# Altium project BMS_Test_Stand.PrjPcb
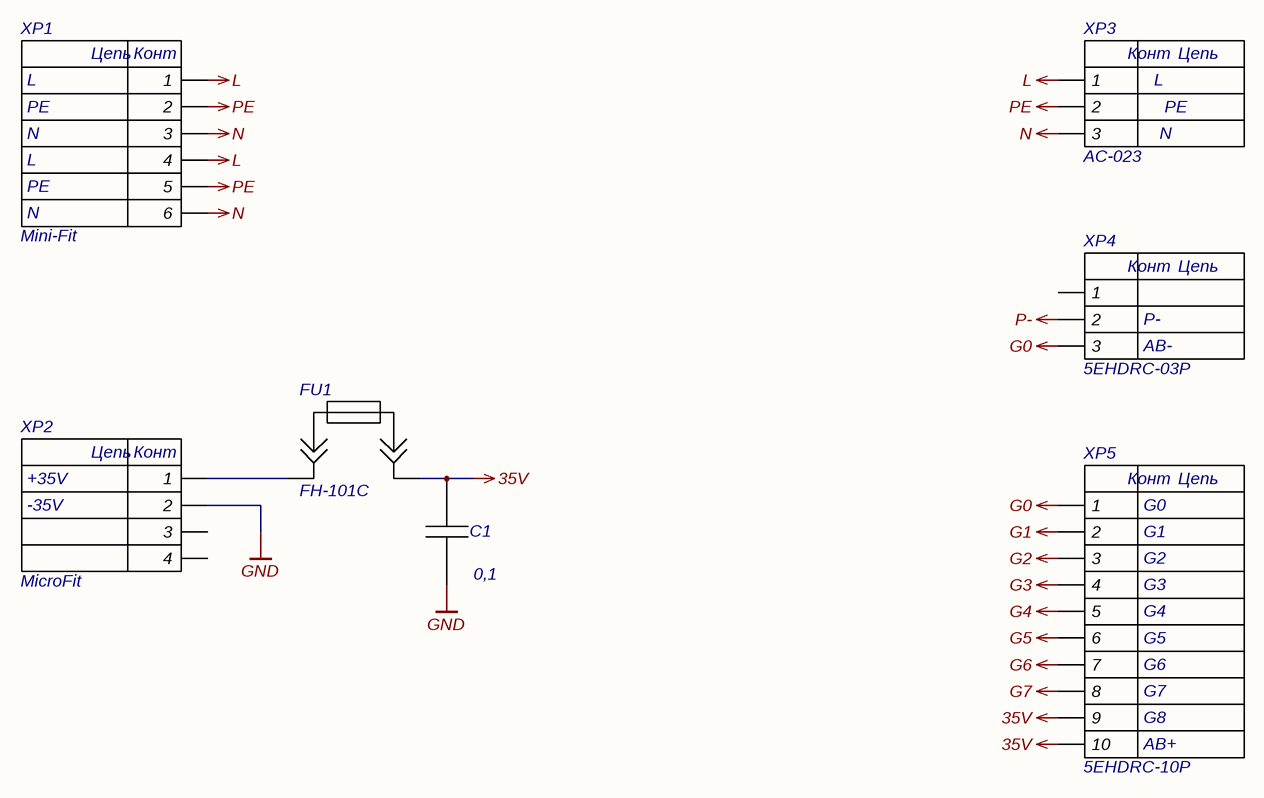
[diagram p0: Conn.SchDoc]
13 sheets, 426 parts. Net scope: global (net labels, ports and power ports of the same name join across sheets).
Board file: Stand.PcbDoc
Sheets:
  Conn.SchDoc
  Mode.SchDoc
  Power.SchDoc
  MCU.SchDoc
  Interface.SchDoc
  BI1.SchDoc
  BI2.SchDoc
  BI3.SchDoc
  BI4.SchDoc
  BI5.SchDoc
  BI6.SchDoc
  BI7.SchDoc
  BI8.SchDoc

## Sheet Conn.SchDoc: Модуль измерительный
size 420 x 297 mm; CheckedBy: Беляев; Author: Петрова; CompanyName: Университет ИТМО; SheetNumber: 1; SheetTotal: 13; PageSetup: Record=PageOptions|CenterHorizontal=True|CenterVertical=True|PrintScale=0.94|XCorrection=1.00|YCorrection=1.00|PrintKind=1|BorderSize=5000000|LeftOffset=0|BottomOffset=0|Orientation=1|PaperLength=1000|PaperWidth=1000|Scale=100|PaperSource=7|PrintQuality=-4|MediaType=1|DitherType=10|PaperKind=A4|PrintScaleMode=1; DecimalNumber: СНАБ.468222.001 ЭЗ; Name: Модуль измерительный; DocumentName: Sheet1.SCHDOC

### Parts
C1  0,1  [С0805]
FU1  FH-101C  [FH-101C]
XP1  Mini-Fit  P6: N  P5: PE  P4: L  [MF2x3MA]
XP2  MicroFit  P2: -35V  P1: +35V  [MF3-04MA]
XP3  AC-023  [IEC-C14]
XP4  5EHDRC-03P  P2: P-  P3: AB-  [5EHDRC-03P]
XP5  5EHDRC-10P  P6: G5  P1: G0  P2: G1  P3: G2  P4: G3  P5: G4  P7: G6  P8: G7  P9: G8  P10: AB+  [5EHDRC-10P]

### Nets
35V: C1.2 FU1.2 XP5.9 XP5.10
G0: XP4.3 XP5.1
G1: XP5.2
G2: XP5.3
G3: XP5.4
G4: XP5.5
G5: XP5.6
G6: XP5.7
G7: XP5.8
GND: C1.1 XP2.2
L: XP1.1 XP1.4 XP3.1
N: XP1.3 XP1.6 XP3.3
P-: XP4.2
PE: XP1.2 XP1.5 XP3.2
NetFU1_1: FU1.1 XP2.1

Not connected (* = marked no-connect by the designer): XP2 3 4; XP4 1

### Notes on the sheet
- Перв.примен.
- Справ.№
- Подп. и дата
- Инв.№ дубл.
- Взам.инв.№
- Подп.и дата
- Разраб.
- Изм.
- Лист
- № докум.
- Подп.
- Дата
- Лит.
- Масса
- Масштаб
- Т.контр.
- Пров.
- Схема электрическая
- принципиальная
- Листов
- Инв.№ подл.
- Утв.
- Н.контр.
- Копировал
- Формат  A3
- (in symbol 5EHDRC-03P) Конт; Цепь
- (in symbol 5EHDRC-10P) Конт; Цепь
- (in symbol 43045-0412) Цепь; Конт
- (in symbol AC-023) Конт; Цепь; L; PE; N
- (in symbol MF2x3MA) Цепь; Конт

### Library data of the parts
C1 = Chip Capasitor: Чип-конденсатор; Value: 0,1
FU1 = FH-101C: Fuse holder 5x20mm; Manufacturer: Dragon City Industries; Case: FH-101C; Name: FH-101C; Datasheet: https://static.chipdip.ru/lib/550/DOC014550336.pdf
XP1 = MF2x3MA: Mini-Fit 4,2mm A Male 6 pin; Manufacturer: Connfly Electronic Co.; Name: DS1073-01-2x3-MVT6; Case: MF2x3MA; P3: N; P2: PE; P1: L
XP2 = 43045-0412: MicroFit 3mm RA Male 4 pin; Manufacturer: Molex Incorporated; Case: MF3-04MA; Name: 43045-0412; TU: *
XP3 = AC-023: Разъём питания AC, одинарный; Manufacturer: RUICHI; Name: AC-023
XP4 = 5EHDRC-03P: Клеммник 3 конт. "вилка" шаг 5.00 мм; Manufacturer: Dinkle Enterprise; Name: 5EHDRC-03P; Datasheet: https://static.chipdip.ru/lib/008/DOC004008828.pdf
XP5 = 5EHDRC-10P: Клеммник 10 конт. "вилка" шаг 5.00 мм; Manufacturer: Dinkle Enterprise; Name: 5EHDRC-10P; Datasheet: https://www.lcsc.com/datasheet/lcsc_datasheet_2311281934_Dinkle-5EHDR-10P_C5515183.pdf

## Sheet Mode.SchDoc: Наименование
size 420 x 297 mm; ApprovedBy: Утвердил; CheckedBy: Проверил; Author: Разработал; CompanyName: ВлГУ; DrawnBy: Н.Контр; Engineer: Т.Контр; SheetNumber: 2; SheetTotal: 1; PageSetup: Record=PageOptions|CenterHorizontal=True|CenterVertical=True|PrintScale=0.94|XCorrection=1.00|YCorrection=1.00|PrintKind=1|BorderSize=5000000|LeftOffset=0|BottomOffset=0|Orientation=1|PaperLength=1000|PaperWidth=1000|Scale=100|PaperSource=7|PrintQuality=-4|MediaType=1|DitherType=10|PaperKind=A4|PrintScaleMode=1; DecimalNumber: СНАБ.468222.001 ЭЗ; HeadOfSector: Нач. сектора; MainDevice: Перв.примен.; Name: Наименование; DocumentName: Sheet1.SCHDOC
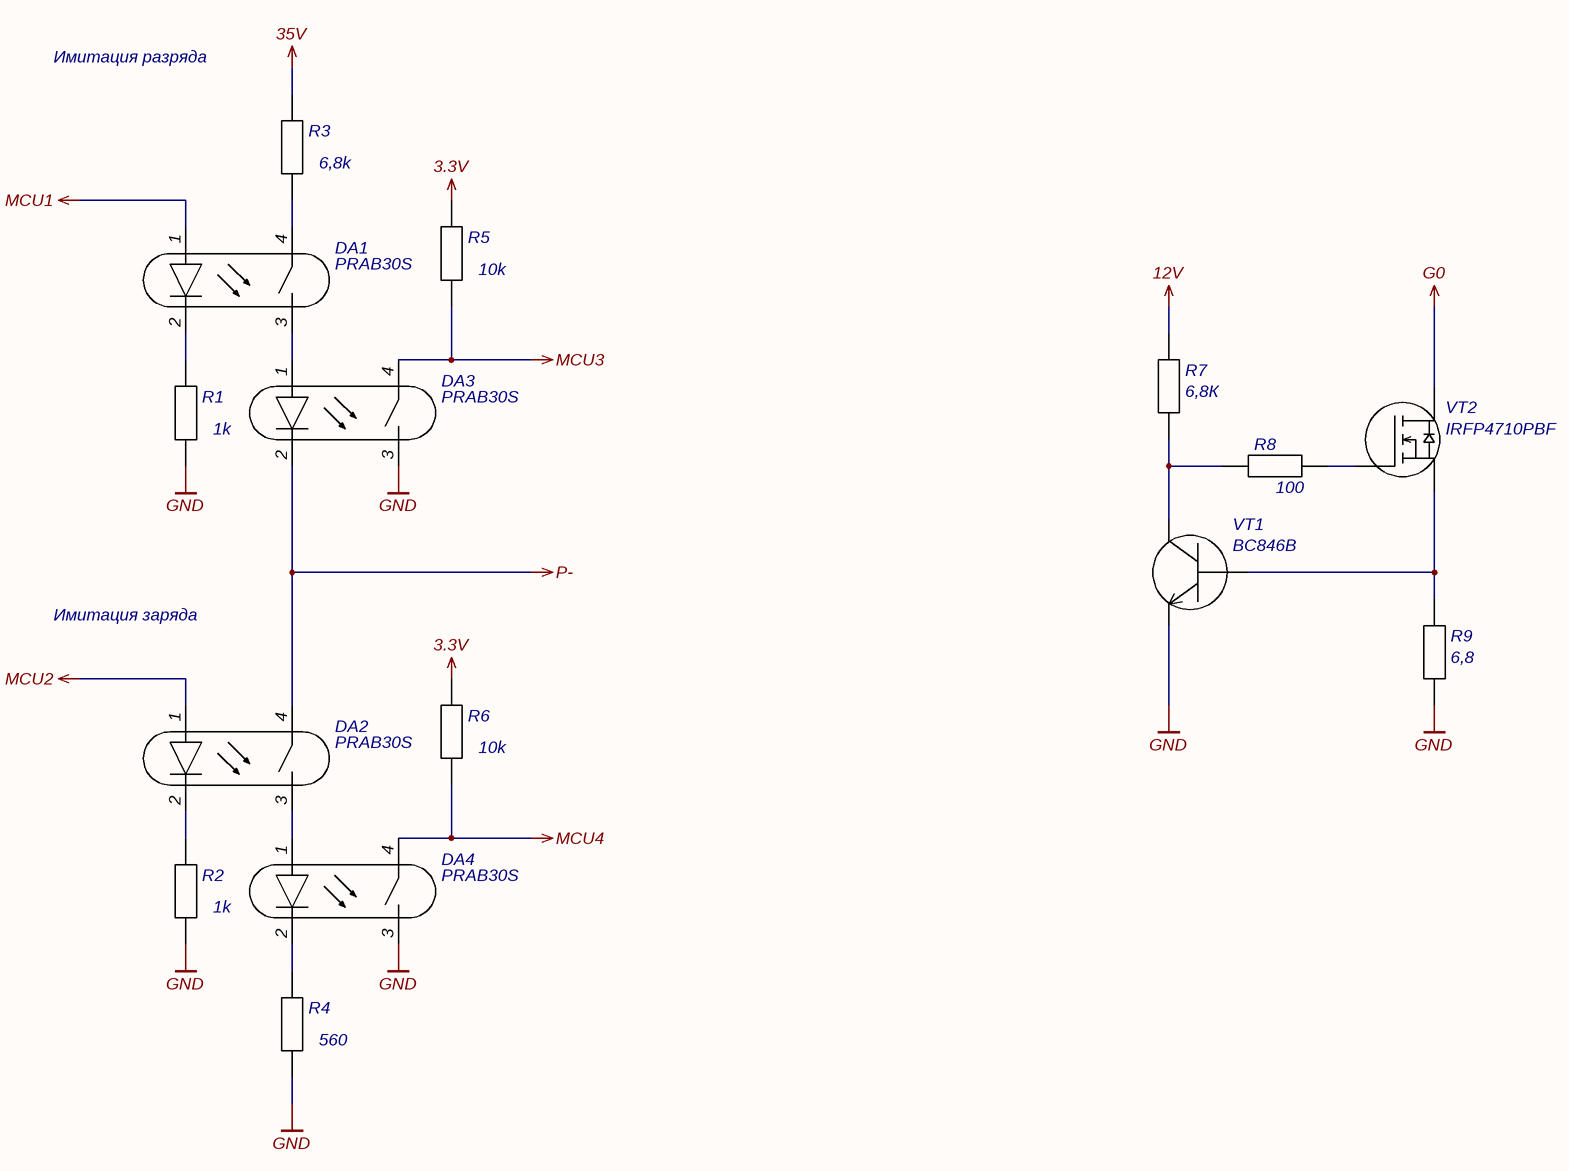
[diagram p1: Mode.SchDoc]

### Parts
DA1  PRAB30S  [SOP-4]
DA2  PRAB30S  [SOP-4]
DA3  PRAB30S  [SOP-4]
DA4  PRAB30S  [SOP-4]
R1  1k  [R0603]
R2  1k  [R0603]
R3  6,8k  [R1206]
R4  560  [R1206]
R5  10k  [R0603]
R6  10k  [R0603]
R7  6,8К  [R1206]
R8  100  [R0603]
R9  6,8  [SQP 5W]
VT1  BC846B  [SOT-23]
VT2  IRFP4710PBF  [TO-247AC]

### Nets
3.3V: R5.2 R6.2
12V: R7.2
35V: R3.2
G0: VT2.2(D)
GND: DA3.3(Out1.2) DA4.3(Out1.2) R1.1 R2.1 R4.1 R9.1 VT1.2(E)
MCU1: DA1.1(A1)
MCU2: DA2.1(A1)
MCU3: DA3.4(Out1.1) R5.1
MCU4: DA4.4(Out1.1) R6.1
P-: DA2.4(Out1.1) DA3.2(K1)
NetDA1_2: DA1.2(K1) R1.2
NetDA1_3: DA1.3(Out1.2) DA3.1(A1)
NetDA1_4: DA1.4(Out1.1) R3.1
NetDA2_2: DA2.2(K1) R2.2
NetDA2_3: DA2.3(Out1.2) DA4.1(A1)
NetDA4_2: DA4.2(K1) R4.2
NetR7_1: R7.1 R8.1 VT1.3(C)
NetR8_2: R8.2 VT2.1(G)
NetR9_2: R9.2 VT1.1(B) VT2.3(S)

### Notes on the sheet
- Имитация разряда
- Имитация заряда
- Подп. и дата
- Инв.№ дубл.
- Взам.инв.№
- Подп.и дата
- Инв.№ подл.
- Изм.
- Лист
- № докум.
- Подп.
- Дата
- Копировал
- Формат  A3

### Library data of the parts
DA1-DA4 = PRAB30S: Реле твердотельное с оптической развязкой; Manufacturer: ОАО «Протон»; Case: SOP-4; Name: PRAB30S; Datasheet: https://static.chipdip.ru/lib/271/DOC000271061.pdf
R1-R8 = Chip Resistor: Чип-резистор
  R1 R2: Value: 1k
  R3: Value: 6,8k
  R4: Value: 560
  R5 R6: Value: 10k
  R7: Value: 6,8К
  R8: Value: 100
R9 = Resistor: Резистор; Value: 6,8
VT1 = BC846B: Транзистор биполярный NPN, 65В; Manufacturer: Nexperia B.V.; Case: SOT-23; Name: BC846B; Datasheet: https://static.chipdip.ru/lib/551/DOC012551042.pdf
VT2 = IRFP4710PBF: Транзистор MOSFET N-канал, 100В; Manufacturer: INFINEON TECHNOLOGIES AG.; Case: TO-247AC; Name: IRFP4710PBF; Datasheet: https://static.chipdip.ru/lib/205/DOC000205410.pdf

## Sheet Power.SchDoc
size 420 x 297 mm; DocumentNumber: 3; SheetNumber: 3; SheetTotal: 13; DecimalNumber: СНАБ.468222.001 ЭЗ
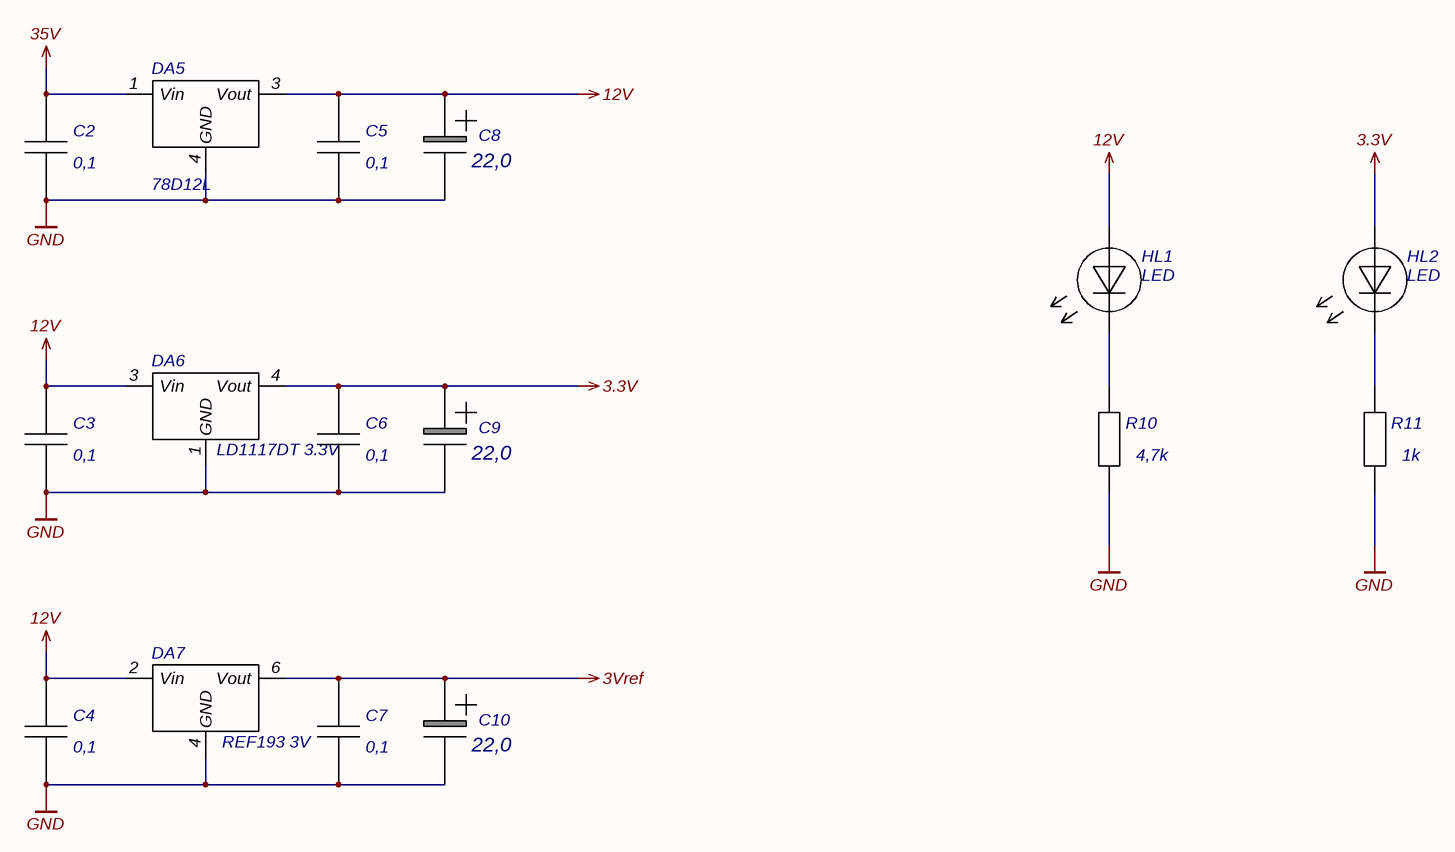
[diagram p2: Power.SchDoc]

### Parts
C2  0,1  [С0805]
C3  0,1  [С0805]
C4  0,1  [С0805]
C5  0,1  [С0805]
C6  0,1  [С0805]
C7  0,1  [С0805]
C8  22,0  [C_tant 3(С-type)]
C9  22,0  [C_tant 3(С-type)]
C10  22,0  [C_tant 3(С-type)]
DA5  78D12L  [DPAK]
DA6  LD1117DT 3.3V  [DPAK]
DA7  REF193 3V  [SOP-8 (SOIC)]
HL1  LED  [LED 5mm (L-7113IT)]
HL2  LED  [LED 5mm (L-7113IT)]
R10  4,7k  [R0603]
R11  1k  [R0603]

### Nets
3.3V: C6.2 C9.1 DA6.4(Vout) HL2.2(A)
3Vref: C7.2 C10.1 DA7.6(Vout)
12V: C3.2 C4.2 C5.2 C8.1 DA5.3(Vout) DA6.3(Vin) DA7.2(Vin) HL1.2(A)
35V: C2.2 DA5.1(Vin)
GND: C2.1 C3.1 C4.1 C5.1 C6.1 C7.1 C8.2 C9.2 C10.2 DA5.4(GND) DA6.1(GND) DA7.4(GND) R10.1 R11.1
NetHL1_1: HL1.1(K) R10.2
NetHL2_1: HL2.1(K) R11.2

### Notes on the sheet
- Подп. и дата
- Инв.№ дубл.
- Взам.инв.№
- Подп.и дата
- Инв.№ подл.
- Изм.
- Лист
- № докум.
- Подп.
- Дата
- Копировал
- Формат  A3

### Library data of the parts
C2-C7 = Chip Capasitor: Чип-конденсатор; Value: 0,1
C8-C10 = К53-67 (3/C): Чип конденсатор (3/C) тант.; Manufacturer: KEMET; Partnumber: Т491С226К010АТ; Case: C_tant 3(С-type); TU: -; Value: 22,0
DA5 = 78D12L: Стабилизатор напряжения, 12В; Manufacturer: UTD Semiconductor Co.,Ltd; Case: DPAK (TO-252); Name: 78D12L; TU: *; Datasheet: https://static.chipdip.ru/lib/619/DOC025619012.pdf
DA6 = LD1117DT33TR: LDO-регулятор напряжения, 3.3В; Manufacturer: STMicroelectronics; Case: DPAK; Name: LD1117DT33TR; Datasheet: https://static.chipdip.ru/lib/677/DOC011677089.pdf
DA7 = REF193: Источник опорного напряжения, 3В; Manufacturer: Analog Devices; Name: REF193GSZ-REEL; Case: SOP-8; Datasheet: https://static.chipdip.ru/lib/039/DOC012039028.pdf
HL1 HL2 = LED: Светодиод, d=5мм; Manufacturer: Kingbright; Name: L-7113IT; Case: L-7113IT; Datasheet: https://static.chipdip.ru/lib/771/DOC059771173.pdf
R10 R11 = Chip Resistor: Чип-резистор
  R10: Value: 4,7k
  R11: Value: 1k

## Sheet MCU.SchDoc
size 420 x 297 mm; DocumentNumber: 4; SheetNumber: 4; SheetTotal: 13; DecimalNumber: СНАБ.468222.001 ЭЗ
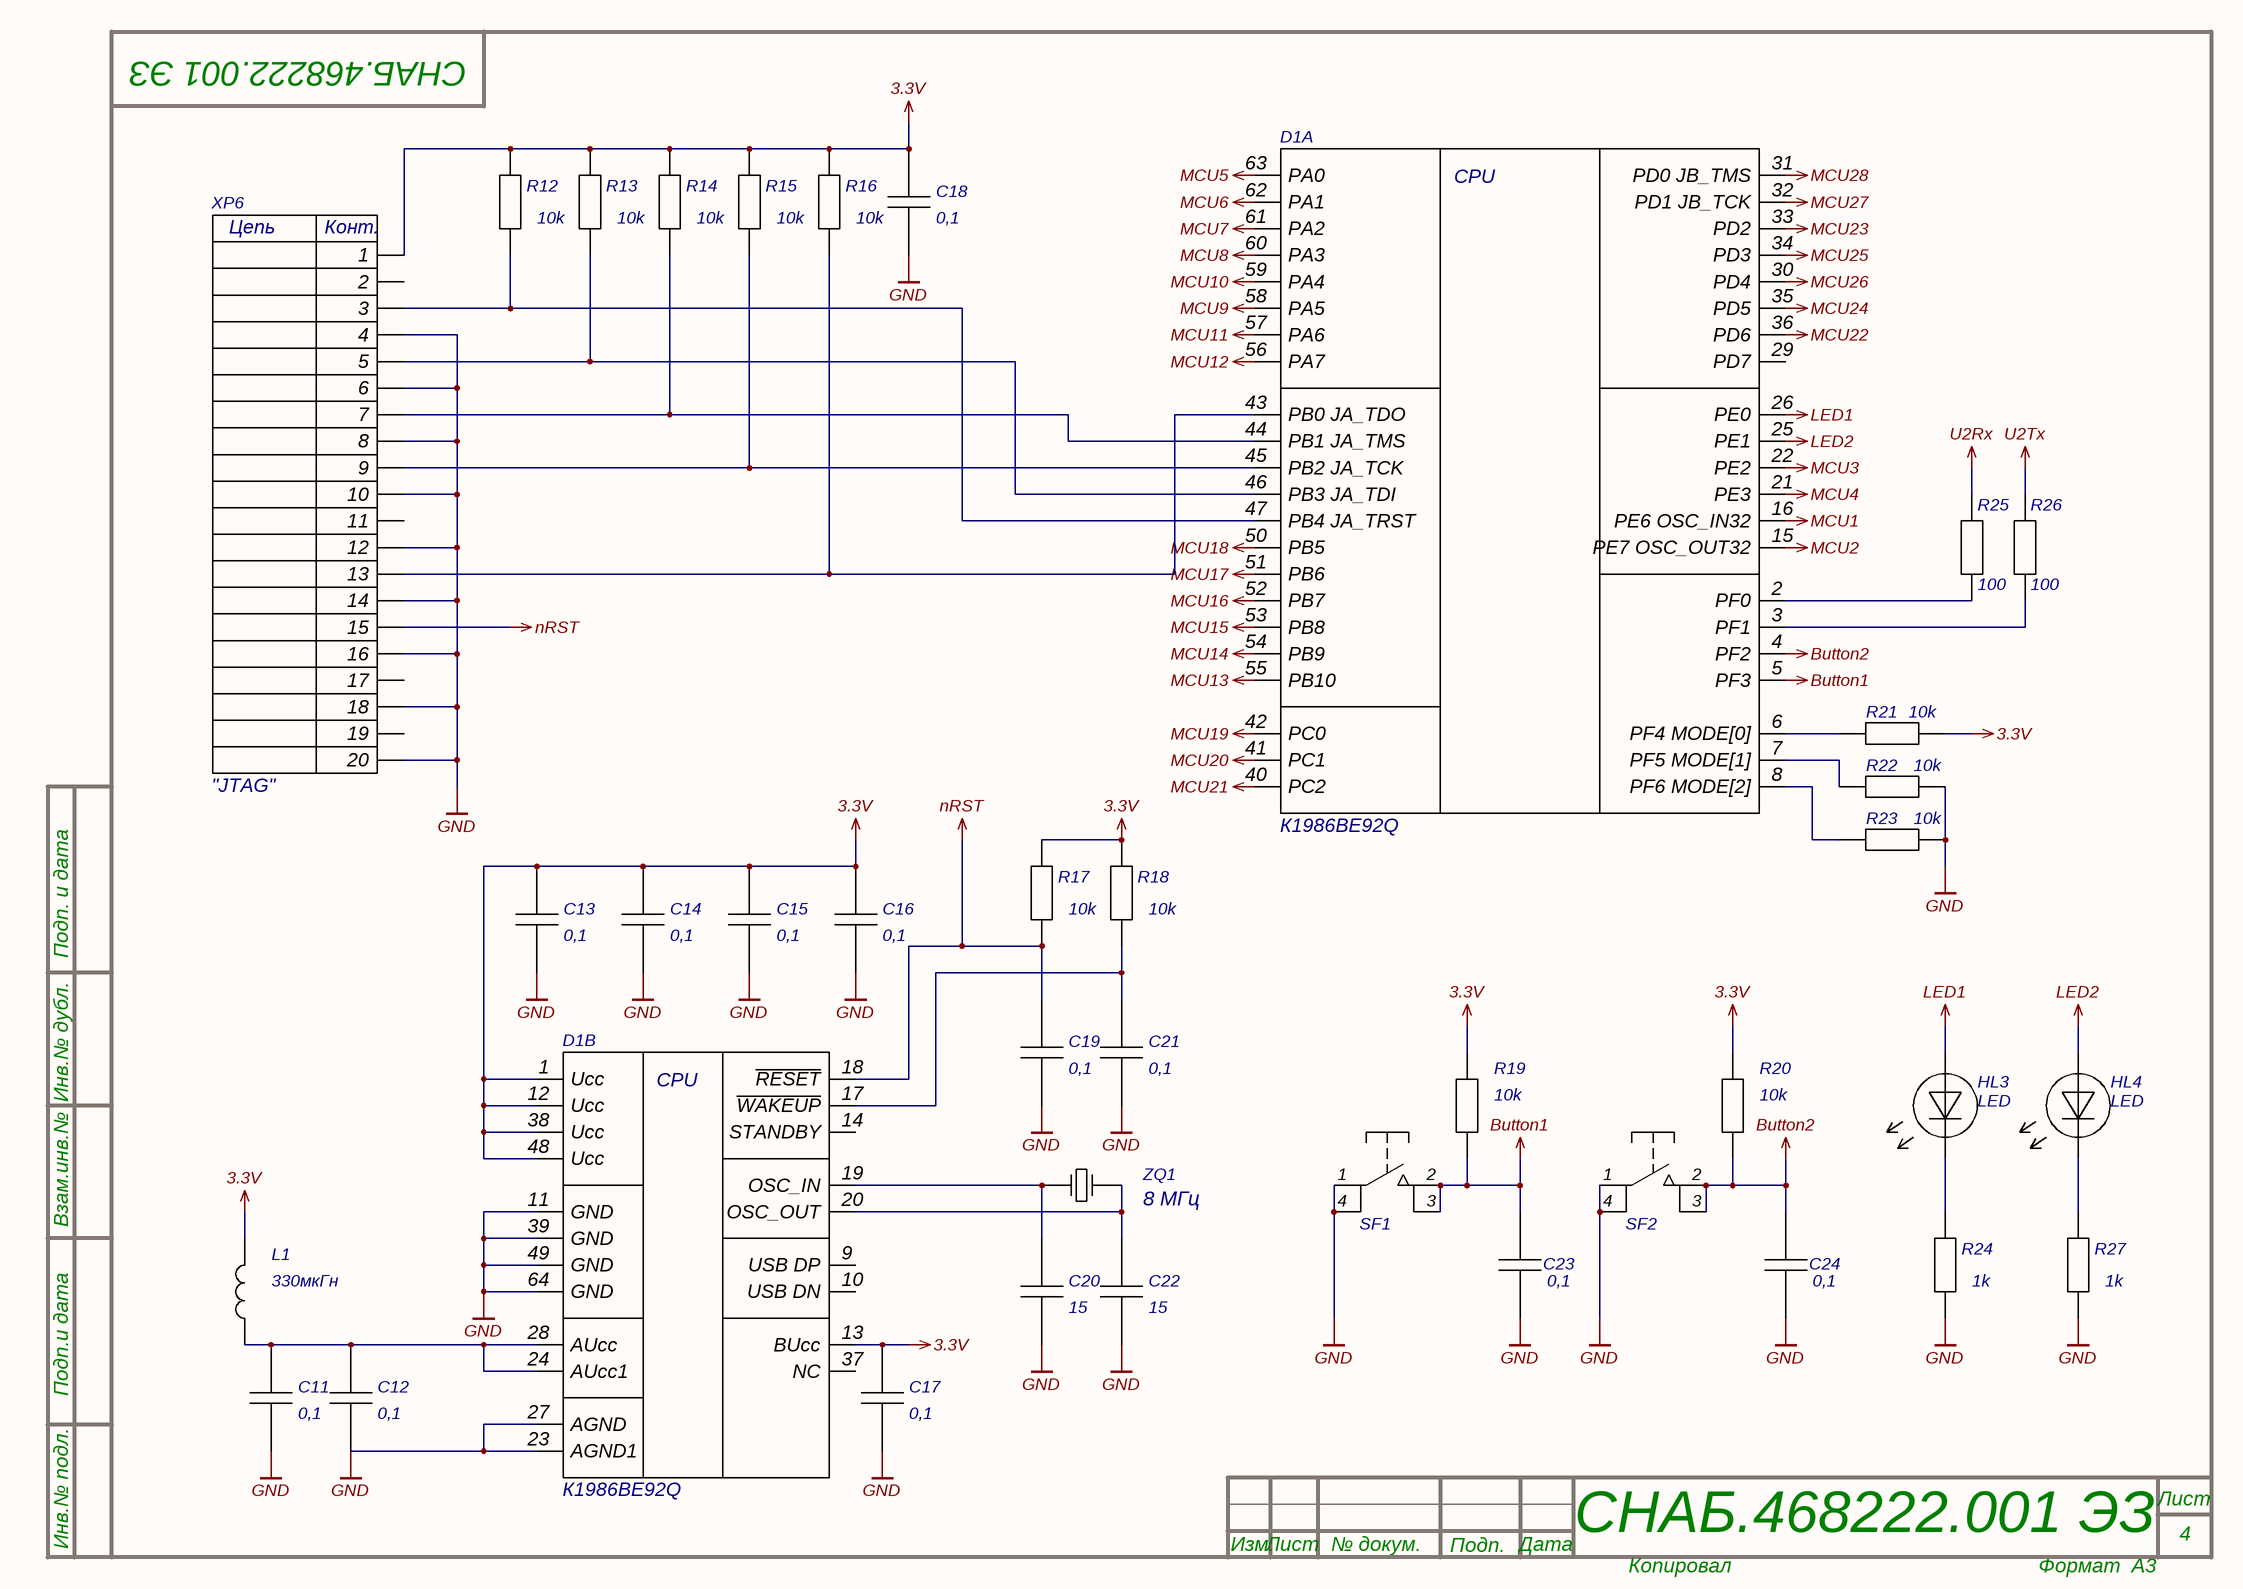
[diagram p3: MCU.SchDoc]

### Parts
C11  0,1  [C0603]
C12  0,1  [C0603]
C13  0,1  [C0603]
C14  0,1  [C0603]
C15  0,1  [C0603]
C16  0,1  [C0603]
C17  0,1  [C0603]
C18  0,1  [C0603]
C19  0,1  [C0603]
C20  15  [C0603]
C21  0,1  [C0603]
C22  15  [C0603]
C23  0,1  [C0603]
C24  0,1  [C0603]
D1  К1986ВЕ92Q  [LQFP64]  (parts A,B of 2)
HL3  LED  [LED 5mm (L-7113IT)]
HL4  LED  [LED 5mm (L-7113IT)]
L1  330мкГн  [LQH43M (1812)]
R12  10k  [R0805]
R13  10k  [R0805]
R14  10k  [R0805]
R15  10k  [R0805]
R16  10k  [R0805]
R17  10k  [R0805]
R18  10k  [R0805]
R19  10k  [R0603]
R20  10k  [R0603]
R21  10k  [R0805]
R22  10k  [R0805]
R23  10k  [R0805]
R24  1k  [R0805]
R25  100  [R0805]
R26  100  [R0805]
R27  1k  [R0805]
SF1  0650HIM-130G-G  [TC-0103]  (value not drawn)
SF2  0650HIM-130G-G  [TC-0103]  (value not drawn)
XP6  "JTAG"  [IDC_20]
ZQ1  8 МГц  [HC-49SM]

### Nets
3.3V: C13.2 C14.2 C15.2 C16.2 C17.2 C18.2 D1.1(Ucc) D1.12(Ucc) D1.13(BUcc) D1.38(Ucc) D1.48(Ucc) L1.2 R12.2 R13.2 R14.2 R15.2 R16.2 R17.2 R18.2 R19.1 R20.1 R21.2 XP6.1
Button1: C23.2 D1.5(PF3) R19.2 SF1.2 SF1.3
Button2: C24.2 D1.4(PF2) R20.2 SF2.2 SF2.3
GND: C11.1 C12.1 C13.1 C14.1 C15.1 C16.1 C17.1 C18.1 C19.1 C20.1 C21.1 C22.1 C23.1 C24.1 D1.11(GND) D1.23(AGND1) D1.27(AGND) D1.39(GND) D1.49(GND) D1.64(GND) R22.2 R23.2 R24.1 R27.1 SF1.1 SF1.4 SF2.1 SF2.4 XP6.4 XP6.6 XP6.8 XP6.10 XP6.12 XP6.14 XP6.16 XP6.18 XP6.20
LED1: D1.26(PE0) HL3.2(A)
LED2: D1.25(PE1) HL4.2(A)
MCU1: D1.16(PE6_OSC_IN32)
MCU2: D1.15(PE7_OSC_OUT32)
MCU3: D1.22(PE2)
MCU4: D1.21(PE3)
MCU5: D1.63(PA0)
MCU6: D1.62(PA1)
MCU7: D1.61(PA2)
MCU8: D1.60(PA3)
MCU9: D1.58(PA5)
MCU10: D1.59(PA4)
MCU11: D1.57(PA6)
MCU12: D1.56(PA7)
MCU13: D1.55(PB10)
MCU14: D1.54(PB9)
MCU15: D1.53(PB8)
MCU16: D1.52(PB7)
MCU17: D1.51(PB6)
MCU18: D1.50(PB5)
MCU19: D1.42(PC0)
MCU20: D1.41(PC1)
MCU21: D1.40(PC2)
MCU22: D1.36(PD6)
MCU23: D1.33(PD2)
MCU24: D1.35(PD5)
MCU25: D1.34(PD3)
MCU26: D1.30(PD4)
MCU27: D1.32(PD1_JB_TCK)
MCU28: D1.31(PD0_JB_TMS)
nRST: C19.2 D1.18(~{RESET}) R17.1 XP6.15
U2Rx: R25.2
U2Tx: R26.2
NetC11_2: C11.2 C12.2 D1.24(AUcc1) D1.28(AUcc) L1.1
NetC20_2: C20.2 D1.19(OSC_IN) ZQ1.1
NetC21_2: C21.2 D1.17(~{WAKEUP}) R18.1
NetC22_2: C22.2 D1.20(OSC_OUT) ZQ1.2
NetD1_2: D1.2(PF0) R25.1
NetD1_3: D1.3(PF1) R26.1
NetD1_6: D1.6(PF4_MODE[0]) R21.1
NetD1_7: D1.7(PF5_MODE[1]) R22.1
NetD1_8: D1.8(PF6_MODE[2]) R23.1
NetD1_43: D1.43(PB0_JA_TDO) R16.1 XP6.13
NetD1_44: D1.44(PB1_JA_TMS) R14.1 XP6.7
NetD1_45: D1.45(PB2_JA_TCK) R15.1 XP6.9
NetD1_46: D1.46(PB3_JA_TDI) R13.1 XP6.5
NetD1_47: D1.47(PB4_JA_TRST) R12.1 XP6.3
NetHL3_1: HL3.1(K) R24.2
NetHL4_1: HL4.1(K) R27.2

Not connected (* = marked no-connect by the designer): D1 9(USB_DP) 10(USB_DN) 14(STANDBY) 29(PD7) 37(NC); XP6 2 11 17 19

### Notes on the sheet
- Подп. и дата
- Инв.№ дубл.
- Взам.инв.№
- Подп.и дата
- Инв.№ подл.
- Изм.
- Лист
- № докум.
- Подп.
- Дата
- Копировал
- Формат  A3
- (in symbol JTAG_20 L) Цепь; Конт.
- (in symbol К1986ВЕ92QI(C)_2parts(LQFP64), part A) CPU
- (in symbol К1986ВЕ92QI(C)_2parts(LQFP64), part B) CPU

### Library data of the parts
C11-C24 = Chip Capasitor: Чип-конденсатор
  C11-C19 C21 C23 C24: Value: 0,1
  C20 C22: Value: 15
D1 = К1986ВЕ92QI(C)_2parts(LQFP64): 32бит микроконтроллер CortexM3; Manufacturer: АО «ПКК Миландр»; TU: ТСКЯ.431296.021СП; Case: LQFP64, пласт.; Name: К1986ВЕ92Q
HL3 HL4 = LED: as HL1 on sheet Power; Case: L-7113IT; Datasheet: https://static.chipdip.ru/lib/771/DOC059771173.pdf
L1 = LQH43MN331K: Чип-индуктивность 95мА, 330мкГн 10%; Manufacturer: Murata Electronics; TU: JELF243A-0043P-01; Case: LQH43M (1812); Name: LQH43MN331K; Datasheet: https://static.chipdip.ru/lib/442/DOC012442357.pdf
R12-R27 = Chip Resistor: Чип-резистор
  R12-R23: Value: 10k
  R24 R27: Value: 1k
  R25 R26: Value: 100
SF1 SF2 = 0650HIM-130G-G: Кнопка тактовая, h=5мм; Manufacturer: Switronic Industrial; Name: 0613HIM-130G-G; Case: TC-0103; Datasheet: https://static.chipdip.ru/lib/154/DOC001154468.pdf
XP6 = JTAG_20 L: J-TAG Connector; Name: DS1013-20S; Manufacturer: *; Case: *
ZQ1 = QuartzRes: Кварцевый резонатор, 8 МГц; Manufacturer: SJK; Case: HC-49SM; Name: QuartzRes; Datasheet: https://static.chipdip.ru/lib/086/DOC053086711.pdf

## Sheet Interface.SchDoc
size 420 x 297 mm; DocumentNumber: 5; SheetNumber: 5; SheetTotal: 13; DecimalNumber: СНАБ.468222.001 ЭЗ
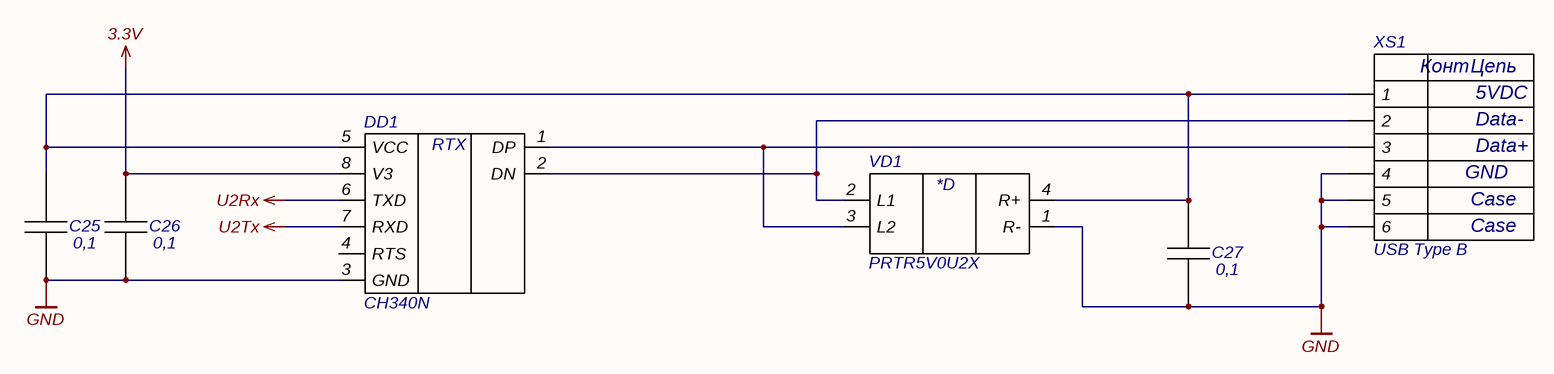
[diagram p4: Interface.SchDoc]

### Parts
C25  0,1  [C0603]
C26  0,1  [C0603]
C27  0,1  [C0603]
DD1  CH340N  [SOP-8 (SOIC)]
VD1  PRTR5V0U2X  [SOT-143]
XS1  USB Type B  [USB Type B]

### Nets
3.3V: C26.2 DD1.8(V3)
GND: C25.1 C26.1 C27.1 DD1.3(GND) VD1.1(R-) XS1.4 XS1.5 XS1.6
U2Rx: DD1.6(TXD)
U2Tx: DD1.7(RXD)
NetC25_2: C25.2 C27.2 DD1.5(VCC) VD1.4(R+) XS1.1
NetDD1_1: DD1.1(DP) VD1.3(L2) XS1.3
NetDD1_2: DD1.2(DN) VD1.2(L1) XS1.2

Not connected (* = marked no-connect by the designer): DD1 4(RTS)

### Notes on the sheet
- Подп. и дата
- Инв.№ дубл.
- Взам.инв.№
- Подп.и дата
- Инв.№ подл.
- Изм.
- Лист
- № докум.
- Подп.
- Дата
- Копировал
- Формат  A3
- (in symbol CH340N) RTX
- (in symbol PRTR5V0U2X) *D
- (in symbol USB Type B) Конт; Цепь; 5VDC; Data-; Data+; GND; Case

### Library data of the parts
C25-C27 = Chip Capasitor: Чип-конденсатор; Value: 0,1
DD1 = CH340N: Преобразователь интерфейса USB в UART; Manufacturer: Nanjing Qinheng Microelectronics; Case: SOP-8; Name: CH340N; Datasheet: https://static.chipdip.ru/lib/375/DOC030375417.pdf
VD1 = PRTR5V0U2X: Защитная диодная сборка от статического заряда; Manufacturer: UTD Semiconductor (UMW); Case: SOT-143; Name: PRTR5V0U2X; Datasheet: https://static.chipdip.ru/lib/303/DOC021303242.pdf
XS1 = USB Type B: Гнездо USB тип B; Manufacturer: Connfly electronic (Zhenqin); Name: USBB-1J; Case: USBB-1J (DS1099-W); Datasheet: https://static.chipdip.ru/lib/252/DOC051252493.pdf

## Sheet BI1.SchDoc
size 420 x 297 mm; DocumentNumber: 6; SheetNumber: 6; SheetTotal: 13; DecimalNumber: СНАБ.468222.001 ЭЗ
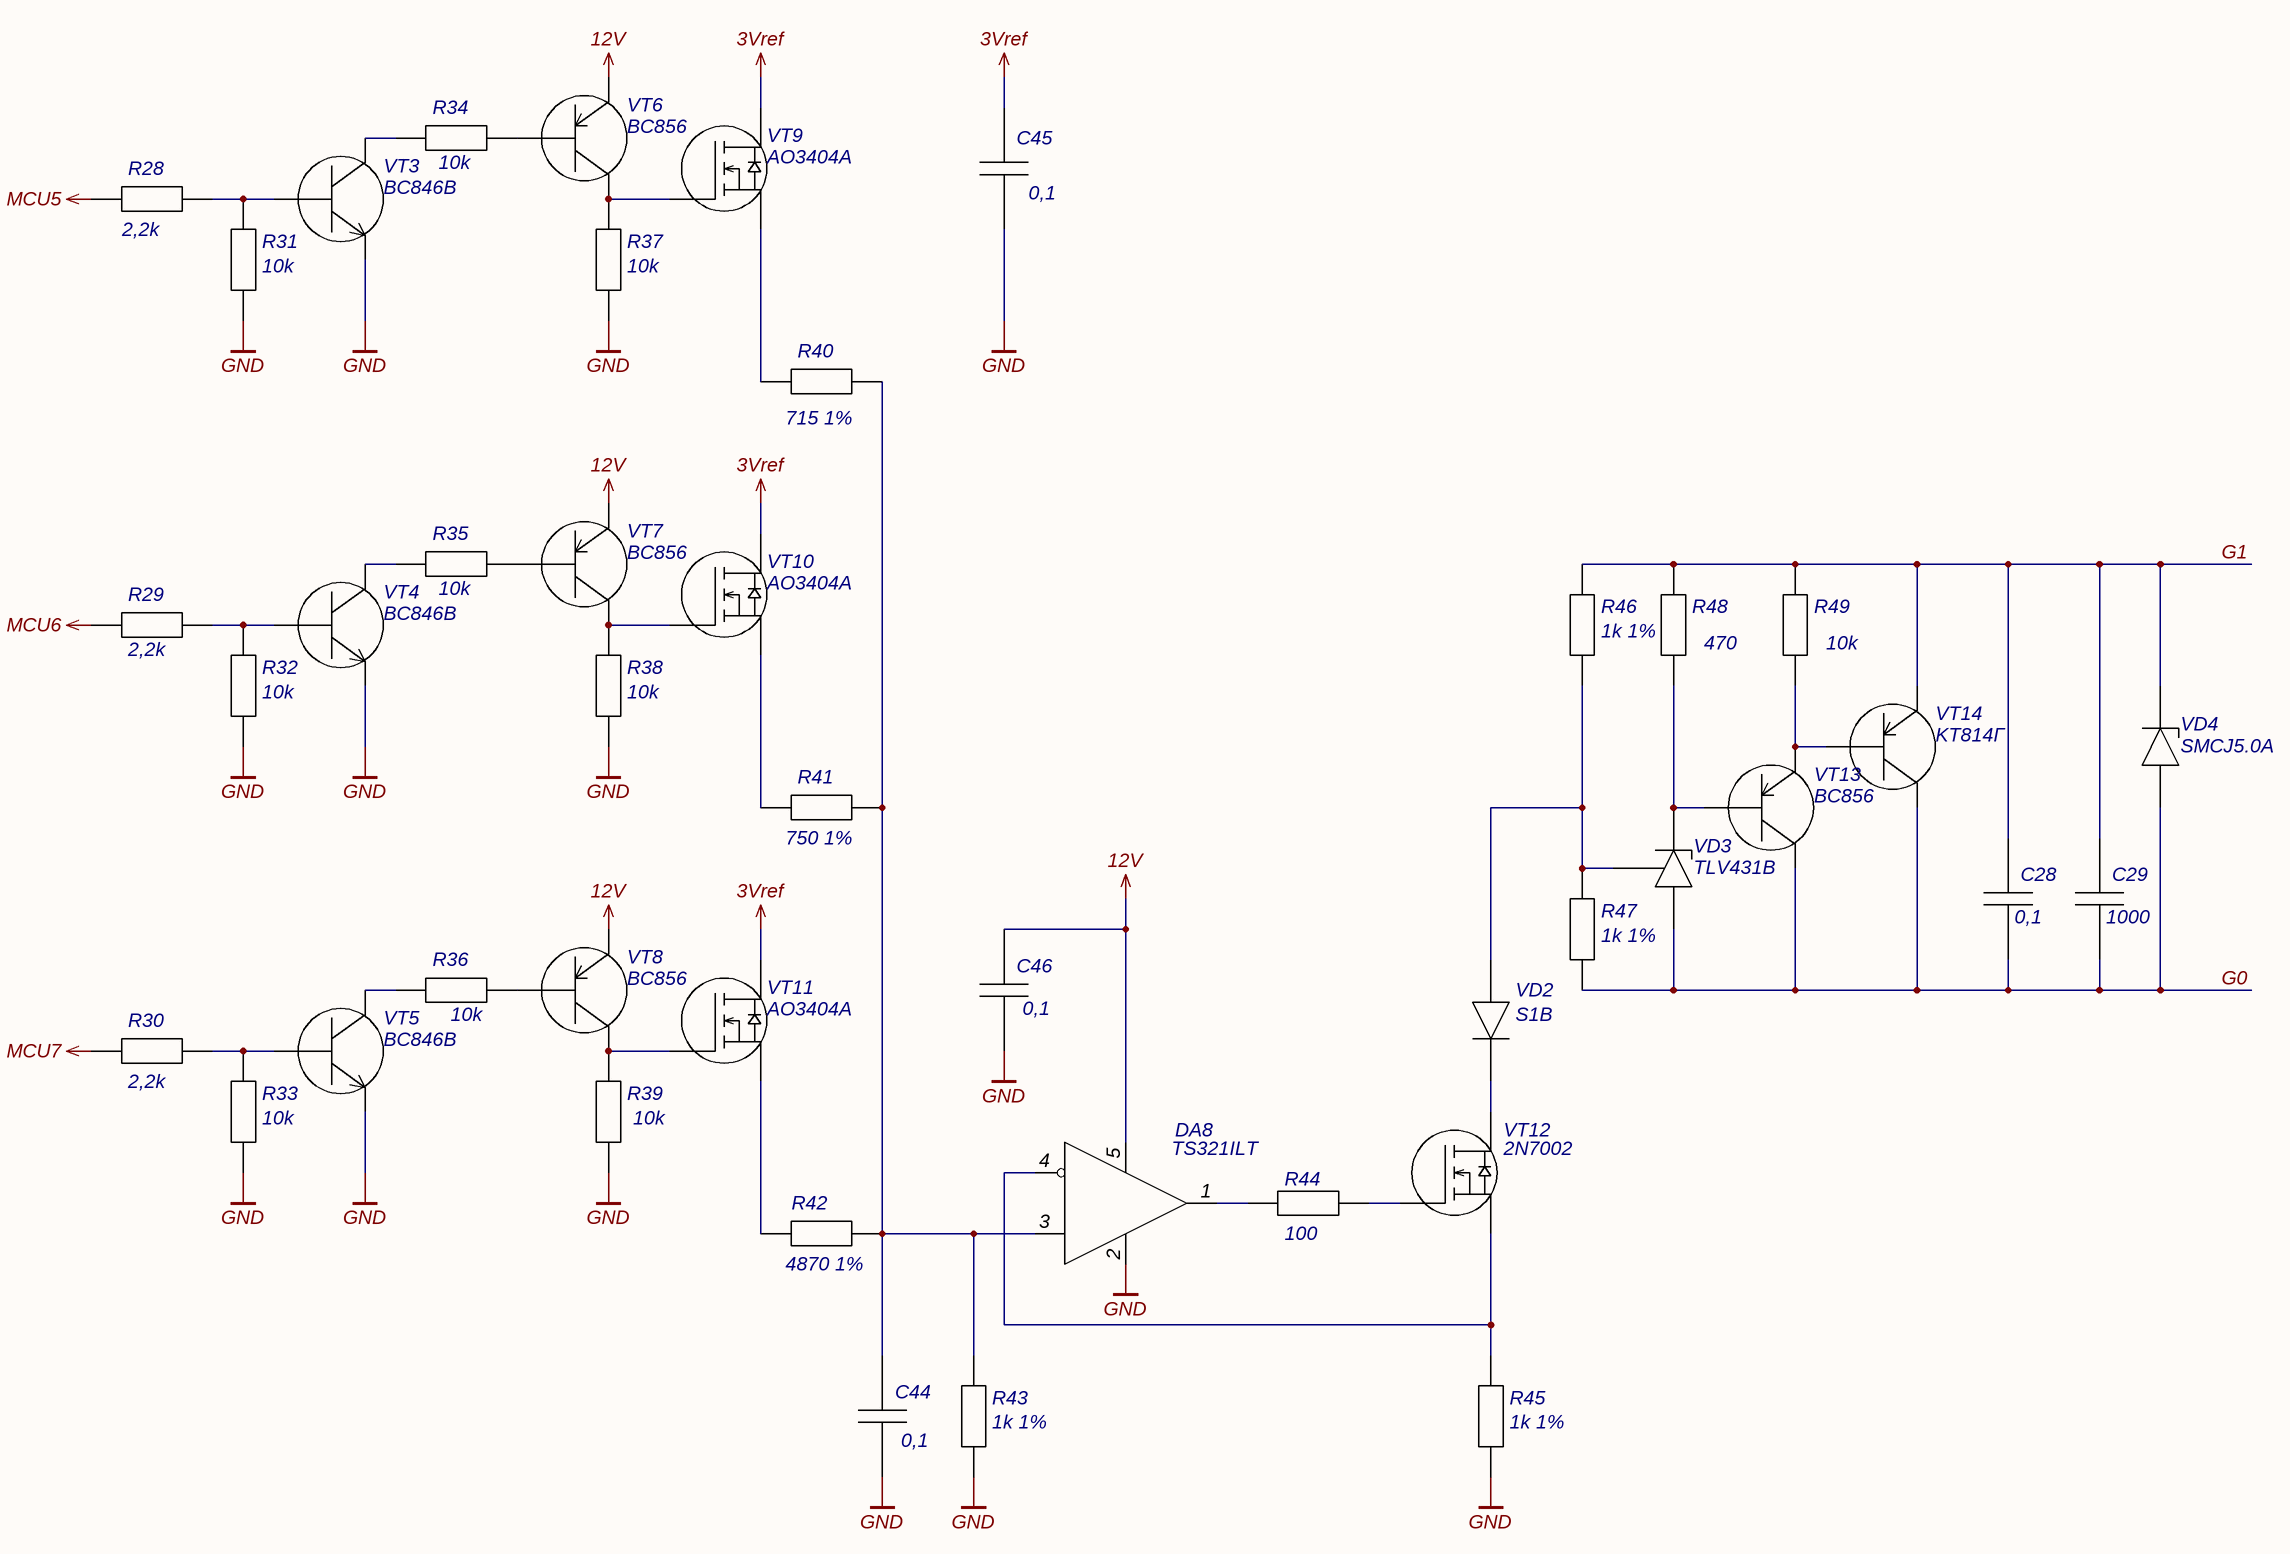
[diagram p5: BI1.SchDoc]

### Parts
C28  0,1  [C0603]
C29  1000  [C0603]
C44  0,1  [C0603]
C45  0,1  [C0603]
C46  0,1  [C0603]
DA8  TS321ILT  [SOT-23-5]
R28  2,2k  [R0603]
R29  2,2k  [R0603]
R30  2,2k  [R0603]
R31  10k  [R0603]
R32  10k  [R0603]
R33  10k  [R0603]
R34  10k  [R0603]
R35  10k  [R0603]
R36  10k  [R0603]
R37  10k  [R0603]
R38  10k  [R0603]
R39  10k  [R0603]
R40  715 1%  [R0603]
R41  750 1%  [R0603]
R42  4870 1%  [R0603]
R43  1k 1%  [R0603]
R44  100  [R0603]
R45  1k 1%  [R0603]
R46  1k 1%  [R0603]
R47  1k 1%  [R0603]
R48  470  [R0603]
R49  10k  [R0603]
VD2  S1B  [DO-214AC]
VD3  TLV431B  [SOT-23]
VD4  SMCJ5.0A  [DO-214AB]
VT3  BC846B  [SOT-23]
VT4  BC846B  [SOT-23]
VT5  BC846B  [SOT-23]
VT6  BC856  [SOT-23]
VT7  BC856  [SOT-23]
VT8  BC856  [SOT-23]
VT9  AO3404A  [SOT-23]
VT10  AO3404A  [SOT-23]
VT11  AO3404A  [SOT-23]
VT12  2N7002  [SOT-23]
VT13  BC856  [SOT-23]
VT14  KT814Г  [TO-126]

### Nets
3Vref: C45.2 VT9.2(D) VT10.2(D) VT11.2(D)
12V: C46.2 DA8.5(Vcc) VT6.1 VT7.1 VT8.1
G0: C28.1 C29.1 R47.1 VD3.1 VD4.1 VT13.2 VT14.2
G1: C28.2 C29.2 R46.2 R48.2 R49.2 VD4.2 VT14.1
GND: C44.1 C45.1 C46.1 DA8.2(GND) R31.1 R32.1 R33.1 R37.1 R38.1 R39.1 R43.1 R45.1 VT3.2(E) VT4.2(E) VT5.2(E)
MCU5: R28.1
MCU6: R29.1
MCU7: R30.1
NetC44_2: C44.2 DA8.3(+) R40.2 R41.2 R42.2 R43.2
NetDA8_1: DA8.1(OUT) R44.1
NetDA8_4: DA8.4(-) R45.2 VT12.3(S)
NetR28_2: R28.2 R31.2 VT3.1(B)
NetR29_2: R29.2 R32.2 VT4.1(B)
NetR30_2: R30.2 R33.2 VT5.1(B)
NetR34_1: R34.1 VT3.3(C)
NetR34_2: R34.2 VT6.3
NetR35_1: R35.1 VT4.3(C)
NetR35_2: R35.2 VT7.3
NetR36_1: R36.1 VT5.3(C)
NetR36_2: R36.2 VT8.3
NetR37_2: R37.2 VT6.2 VT9.1(G)
NetR38_2: R38.2 VT7.2 VT10.1(G)
NetR39_2: R39.2 VT8.2 VT11.1(G)
NetR40_1: R40.1 VT9.3(S)
NetR41_1: R41.1 VT10.3(S)
NetR42_1: R42.1 VT11.3(S)
NetR44_2: R44.2 VT12.1(G)
NetR46_1: R46.1 R47.2 VD2.1 VD3.3
NetR48_1: R48.1 VD3.2 VT13.3
NetR49_1: R49.1 VT13.1 VT14.3
NetVD2_2: VD2.2 VT12.2(D)

### Notes on the sheet
- Подп. и дата
- Инв.№ дубл.
- Взам.инв.№
- Подп.и дата
- Инв.№ подл.
- Изм.
- Лист
- № докум.
- Подп.
- Дата
- Копировал
- Формат  A3

### Library data of the parts
C28 C29 C44-C46 = Chip Capasitor: Чип-конденсатор
  C28 C44-C46: Value: 0,1
  C29: Value: 1000
DA8 = TS321ILT: 1х Операционный усилитель; Manufacurer: STMicroelectronics; Case: SOT-23-5; Name: TS321ILT; Datasheet: https://static.chipdip.ru/lib/710/DOC011710227.pdf
R28-R39 R44 R48 R49 = Chip Resistor: Чип-резистор
  R28-R30: Value: 2,2k
  R31-R39 R49: Value: 10k
  R44: Value: 100
  R48: Value: 470
R40 = Chip Resistor: Чип-резистор; Partnumber: RC0603FR-07715RL; Value: 715 1%; URL: https://www.chipdip.ru/product0/8002000768
R41 = Chip Resistor: Чип-резистор; Partnumber: RC0603FR-07750RL; Value: 750 1%; URL: https://www.chipdip.ru/product/0.1w-0603-750-om-1
R42 = Chip Resistor: Чип-резистор; Partnumber: RC0603FR-074K87L; Value: 4870 1%; URL: https://www.chipdip.ru/product0/8002000679
R43 R45-R47 = Chip Resistor: Чип-резистор; Partnumber: CRCW06031K00FKEAC; Value: 1k 1%; URL: https://www.chipdip.ru/product0/8002019285
VD2 = S1B: Диод выпрямительный, 100В; Manufacturer: Diotec Semiconductor; Case: DO-214AC; Name: S1B; Datasheet: https://static.chipdip.ru/lib/113/DOC032113174.pdf
VD3 = TLV431B: Стабилитрон регулируемый, 6В; Manufacturer: Texas Instruments; Case: SOT-23; Name: TLV431B; Datasheet: https://static.chipdip.ru/lib/985/DOC012985043.pdf
VD4 = SMCJ5.0A: Защитный диод, 5В; Manufacturer: UTD Semiconductor Co.,Ltd; Case: DO-201; Name: SMCJ5.0A; Datasheet: https://static.chipdip.ru/lib/863/DOC025863760.pdf
VT3-VT5 = BC846B: as VT1 on sheet Mode; Case: SOT-23; Name: BC846B; Datasheet: https://static.chipdip.ru/lib/551/DOC012551042.pdf
VT6-VT8 VT13 = BC856: Транзистор биполярный PNP, 65В; Manufacturer: Nexperia; Case: SOT-23; Name: BC856; Datasheet: https://static.chipdip.ru/lib/365/DOC004365998.pdf
VT9-VT11 = AO3404A: Транзистор MOSFET N-канал, 30В; Manufacturer: UTD Semiconductor Co.,Ltd; Case: SOT-23; Name: AO3404A; Datasheet: https://static.chipdip.ru/lib/906/DOC012906979.pdf
VT12 = 2N7002: Транзистор MOSFET N-канал, 60В; Manufacturer: UTD Semiconductor Co.; Case: SOT-23; Name: 2N7002; Datasheet: https://static.chipdip.ru/lib/301/DOC021301072.pdf
VT14 = KT814Г: Транзистор биполярный PNP, 100В; Manufacturer: АО «ГРУППА КРЕМНИЙ ЭЛ»; TU: аАО.336.184 ТУ/02; Case: TO-126; Name: KT814Г; Datasheet: https://static.chipdip.ru/lib/404/DOC047404057.pdf

## Sheet BI2.SchDoc
size 420 x 297 mm; DocumentNumber: 7; SheetNumber: 7; SheetTotal: 13; DecimalNumber: СНАБ.468222.001 ЭЗ
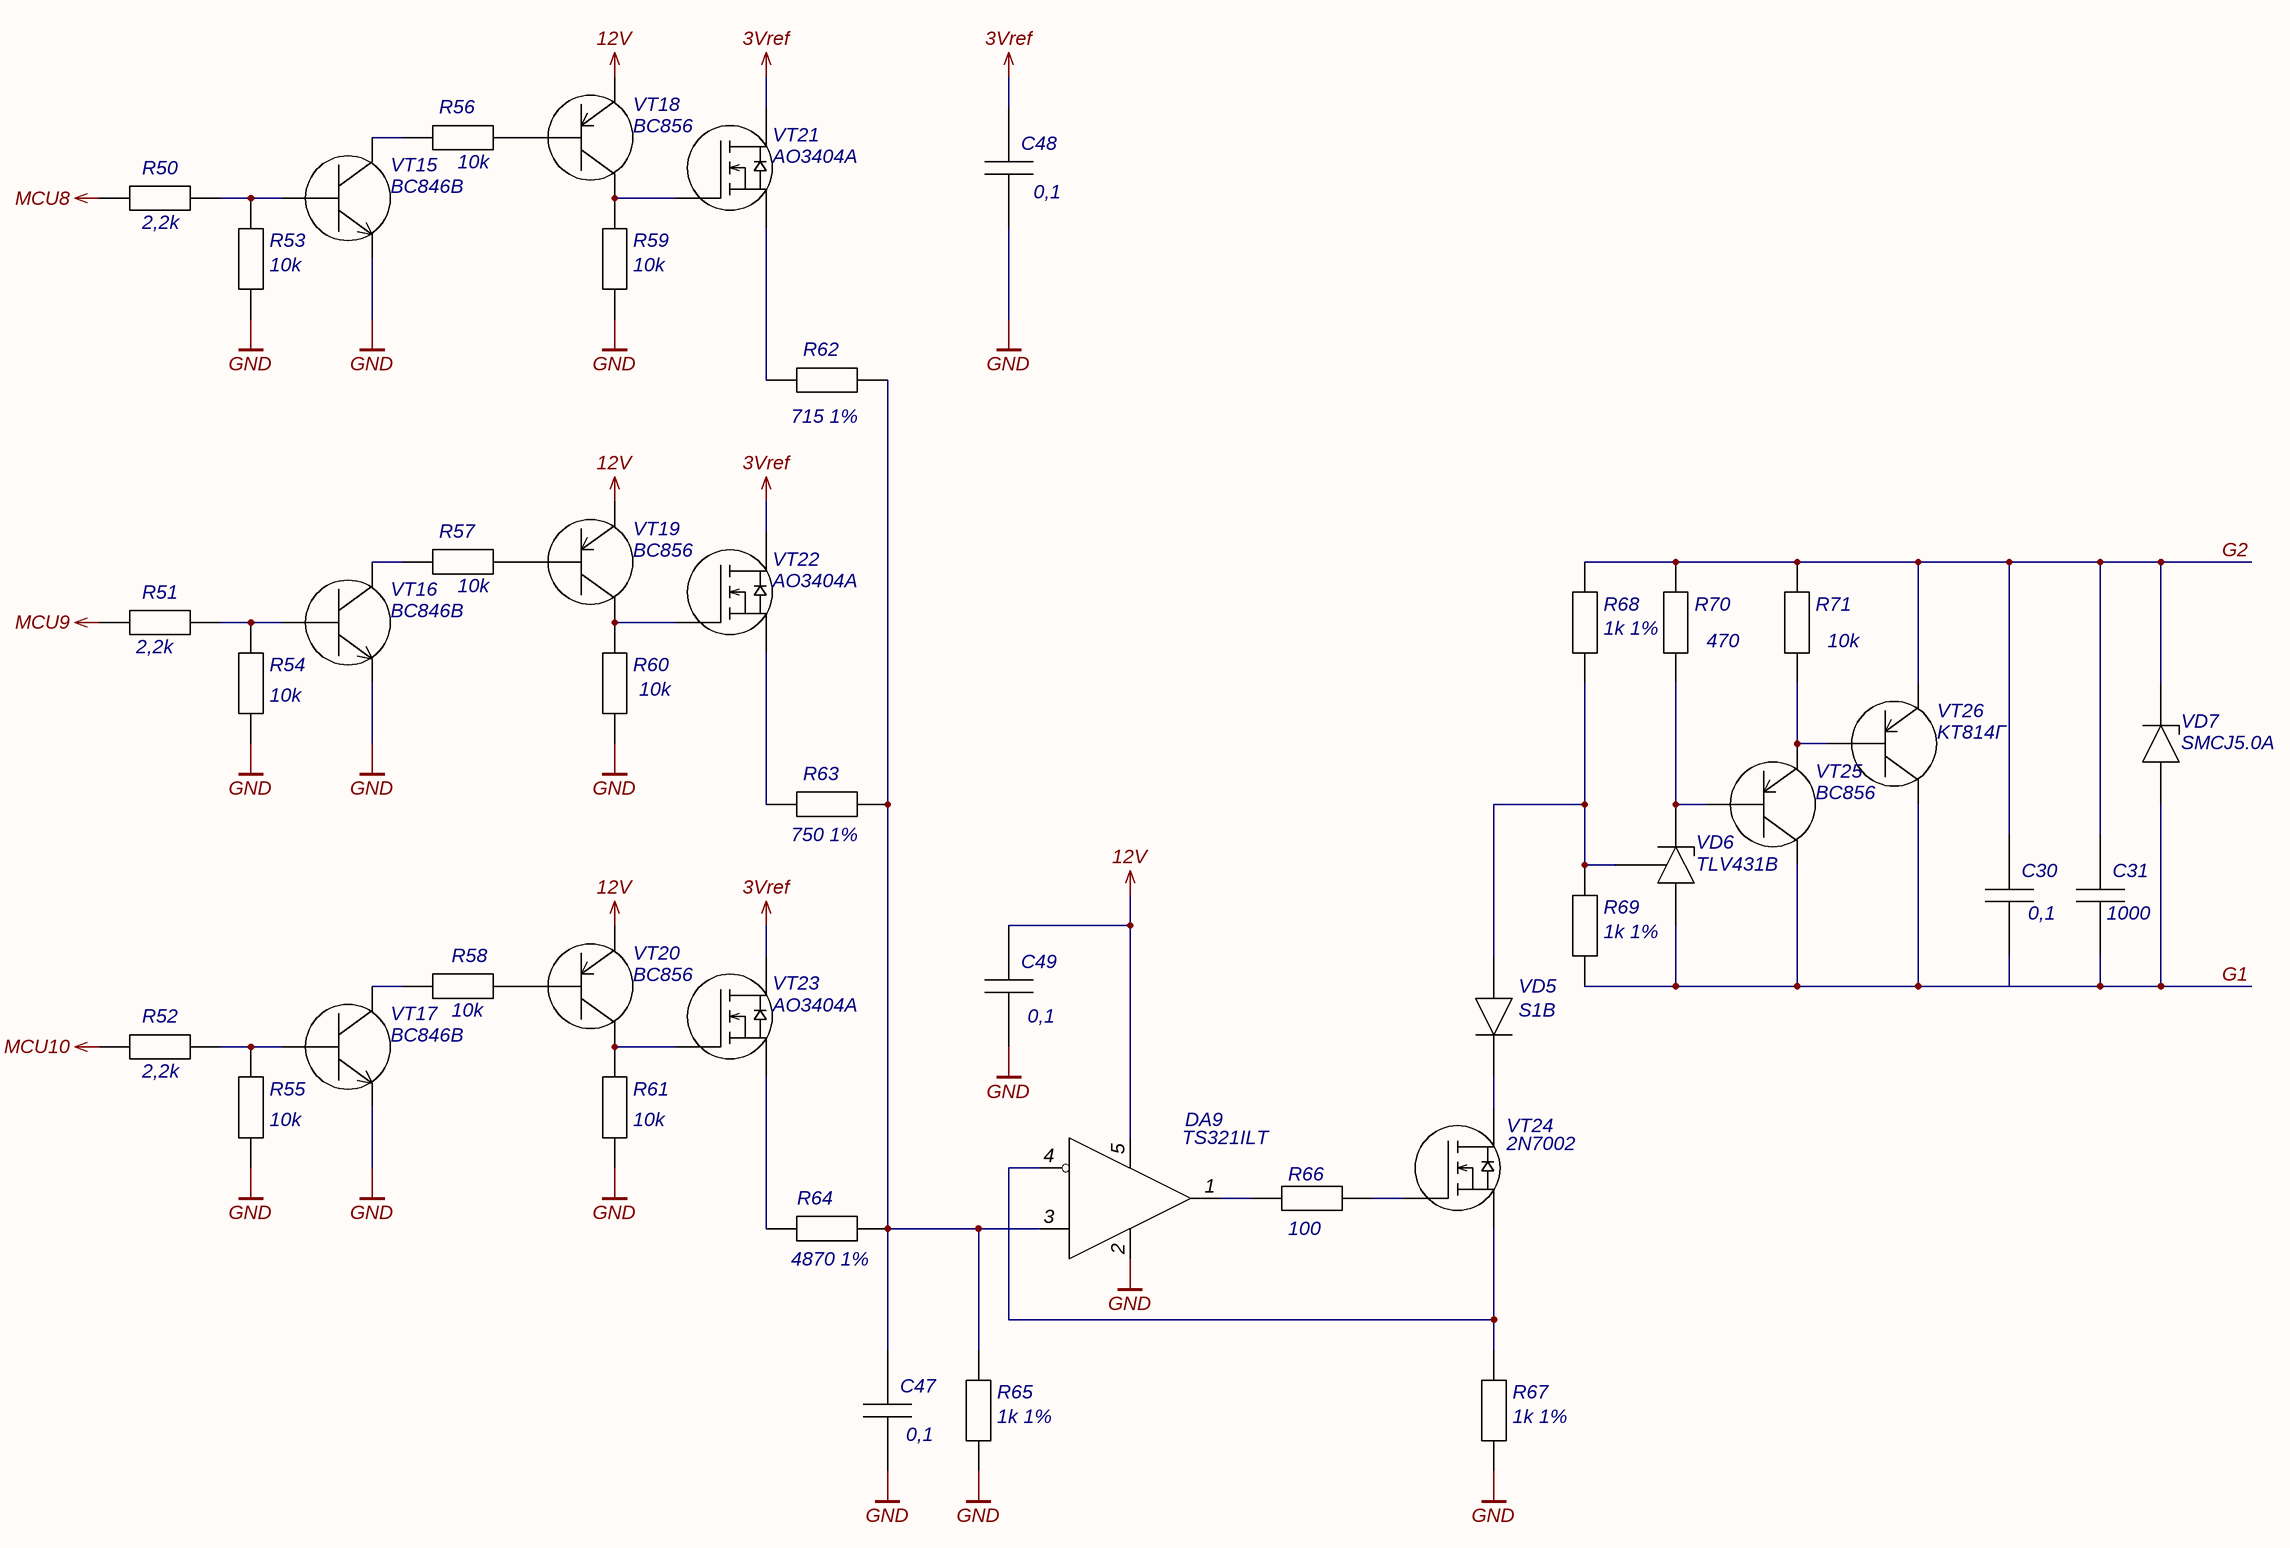
[diagram p6: BI2.SchDoc]

### Parts
C30  0,1  [C0603]
C31  1000  [C0603]
C47  0,1  [C0603]
C48  0,1  [C0603]
C49  0,1  [C0603]
DA9  TS321ILT  [SOT-23-5]
R50  2,2k  [R0603]
R51  2,2k  [R0603]
R52  2,2k  [R0603]
R53  10k  [R0603]
R54  10k  [R0603]
R55  10k  [R0603]
R56  10k  [R0603]
R57  10k  [R0603]
R58  10k  [R0603]
R59  10k  [R0603]
R60  10k  [R0603]
R61  10k  [R0603]
R62  715 1%  [R0603]
R63  750 1%  [R0603]
R64  4870 1%  [R0603]
R65  1k 1%  [R0603]
R66  100  [R0603]
R67  1k 1%  [R0603]
R68  1k 1%  [R0603]
R69  1k 1%  [R0603]
R70  470  [R0603]
R71  10k  [R0603]
VD5  S1B  [DO-214AC]
VD6  TLV431B  [SOT-23]
VD7  SMCJ5.0A  [DO-214AB]
VT15  BC846B  [SOT-23]
VT16  BC846B  [SOT-23]
VT17  BC846B  [SOT-23]
VT18  BC856  [SOT-23]
VT19  BC856  [SOT-23]
VT20  BC856  [SOT-23]
VT21  AO3404A  [SOT-23]
VT22  AO3404A  [SOT-23]
VT23  AO3404A  [SOT-23]
VT24  2N7002  [SOT-23]
VT25  BC856  [SOT-23]
VT26  KT814Г  [TO-126]

### Nets
3Vref: C48.2 VT21.2(D) VT22.2(D) VT23.2(D)
12V: C49.2 DA9.5(Vcc) VT18.1 VT19.1 VT20.1
G1: C30.1 C31.1 R69.1 VD6.1 VD7.1 VT25.2 VT26.2
G2: C30.2 C31.2 R68.2 R70.2 R71.2 VD7.2 VT26.1
GND: C47.1 C48.1 C49.1 DA9.2(GND) R53.1 R54.1 R55.1 R59.1 R60.1 R61.1 R65.1 R67.1 VT15.2(E) VT16.2(E) VT17.2(E)
MCU8: R50.1
MCU9: R51.1
MCU10: R52.1
NetC47_2: C47.2 DA9.3(+) R62.2 R63.2 R64.2 R65.2
NetDA9_1: DA9.1(OUT) R66.1
NetDA9_4: DA9.4(-) R67.2 VT24.3(S)
NetR50_2: R50.2 R53.2 VT15.1(B)
NetR51_2: R51.2 R54.2 VT16.1(B)
NetR52_2: R52.2 R55.2 VT17.1(B)
NetR56_1: R56.1 VT15.3(C)
NetR56_2: R56.2 VT18.3
NetR57_1: R57.1 VT16.3(C)
NetR57_2: R57.2 VT19.3
NetR58_1: R58.1 VT17.3(C)
NetR58_2: R58.2 VT20.3
NetR59_2: R59.2 VT18.2 VT21.1(G)
NetR60_2: R60.2 VT19.2 VT22.1(G)
NetR61_2: R61.2 VT20.2 VT23.1(G)
NetR62_1: R62.1 VT21.3(S)
NetR63_1: R63.1 VT22.3(S)
NetR64_1: R64.1 VT23.3(S)
NetR66_2: R66.2 VT24.1(G)
NetR68_1: R68.1 R69.2 VD5.1 VD6.3
NetR70_1: R70.1 VD6.2 VT25.3
NetR71_1: R71.1 VT25.1 VT26.3
NetVD5_2: VD5.2 VT24.2(D)

### Notes on the sheet
- Подп. и дата
- Инв.№ дубл.
- Взам.инв.№
- Подп.и дата
- Инв.№ подл.
- Изм.
- Лист
- № докум.
- Подп.
- Дата
- Копировал
- Формат  A3

### Library data of the parts
C30 C31 C47-C49 = Chip Capasitor: Чип-конденсатор
  C30 C47-C49: Value: 0,1
  C31: Value: 1000
DA9 = TS321ILT: as DA8 on sheet BI1; Case: SOT-23-5; Name: TS321ILT; Datasheet: https://static.chipdip.ru/lib/710/DOC011710227.pdf
R50-R61 R66 R70 R71 = Chip Resistor: Чип-резистор
  R50-R52: Value: 2,2k
  R53-R61 R71: Value: 10k
  R66: Value: 100
  R70: Value: 470
R62 = Chip Resistor: as R40 on sheet BI1; Value: 715 1%; URL: https://www.chipdip.ru/product0/8002000768
R63 = Chip Resistor: as R41 on sheet BI1; Value: 750 1%; URL: https://www.chipdip.ru/product/0.1w-0603-750-om-1
R64 = Chip Resistor: as R42 on sheet BI1; Value: 4870 1%; URL: https://www.chipdip.ru/product0/8002000679
R65 R67-R69 = Chip Resistor: as R43 on sheet BI1; Value: 1k 1%; URL: https://www.chipdip.ru/product0/8002019285
VD5 = S1B: as VD2 on sheet BI1; Case: DO-214AC; Name: S1B; Datasheet: https://static.chipdip.ru/lib/113/DOC032113174.pdf
VD6 = TLV431B: as VD3 on sheet BI1; Case: SOT-23; Name: TLV431B; Datasheet: https://static.chipdip.ru/lib/985/DOC012985043.pdf
VD7 = SMCJ5.0A: as VD4 on sheet BI1; Case: DO-201; Name: SMCJ5.0A; Datasheet: https://static.chipdip.ru/lib/863/DOC025863760.pdf
VT15-VT17 = BC846B: as VT1 on sheet Mode; Case: SOT-23; Name: BC846B; Datasheet: https://static.chipdip.ru/lib/551/DOC012551042.pdf
VT18-VT20 VT25 = BC856: as VT6 on sheet BI1; Case: SOT-23; Name: BC856; Datasheet: https://static.chipdip.ru/lib/365/DOC004365998.pdf
VT21-VT23 = AO3404A: as VT9 on sheet BI1; Case: SOT-23; Name: AO3404A; Datasheet: https://static.chipdip.ru/lib/906/DOC012906979.pdf
VT24 = 2N7002: as VT12 on sheet BI1; Case: SOT-23; Name: 2N7002; Datasheet: https://static.chipdip.ru/lib/301/DOC021301072.pdf
VT26 = KT814Г: as VT14 on sheet BI1; Case: TO-126; Name: KT814Г; Datasheet: https://static.chipdip.ru/lib/404/DOC047404057.pdf

## Sheet BI3.SchDoc
size 420 x 297 mm; DocumentNumber: 8; SheetNumber: 8; SheetTotal: 13; DecimalNumber: СНАБ.468222.001 ЭЗ
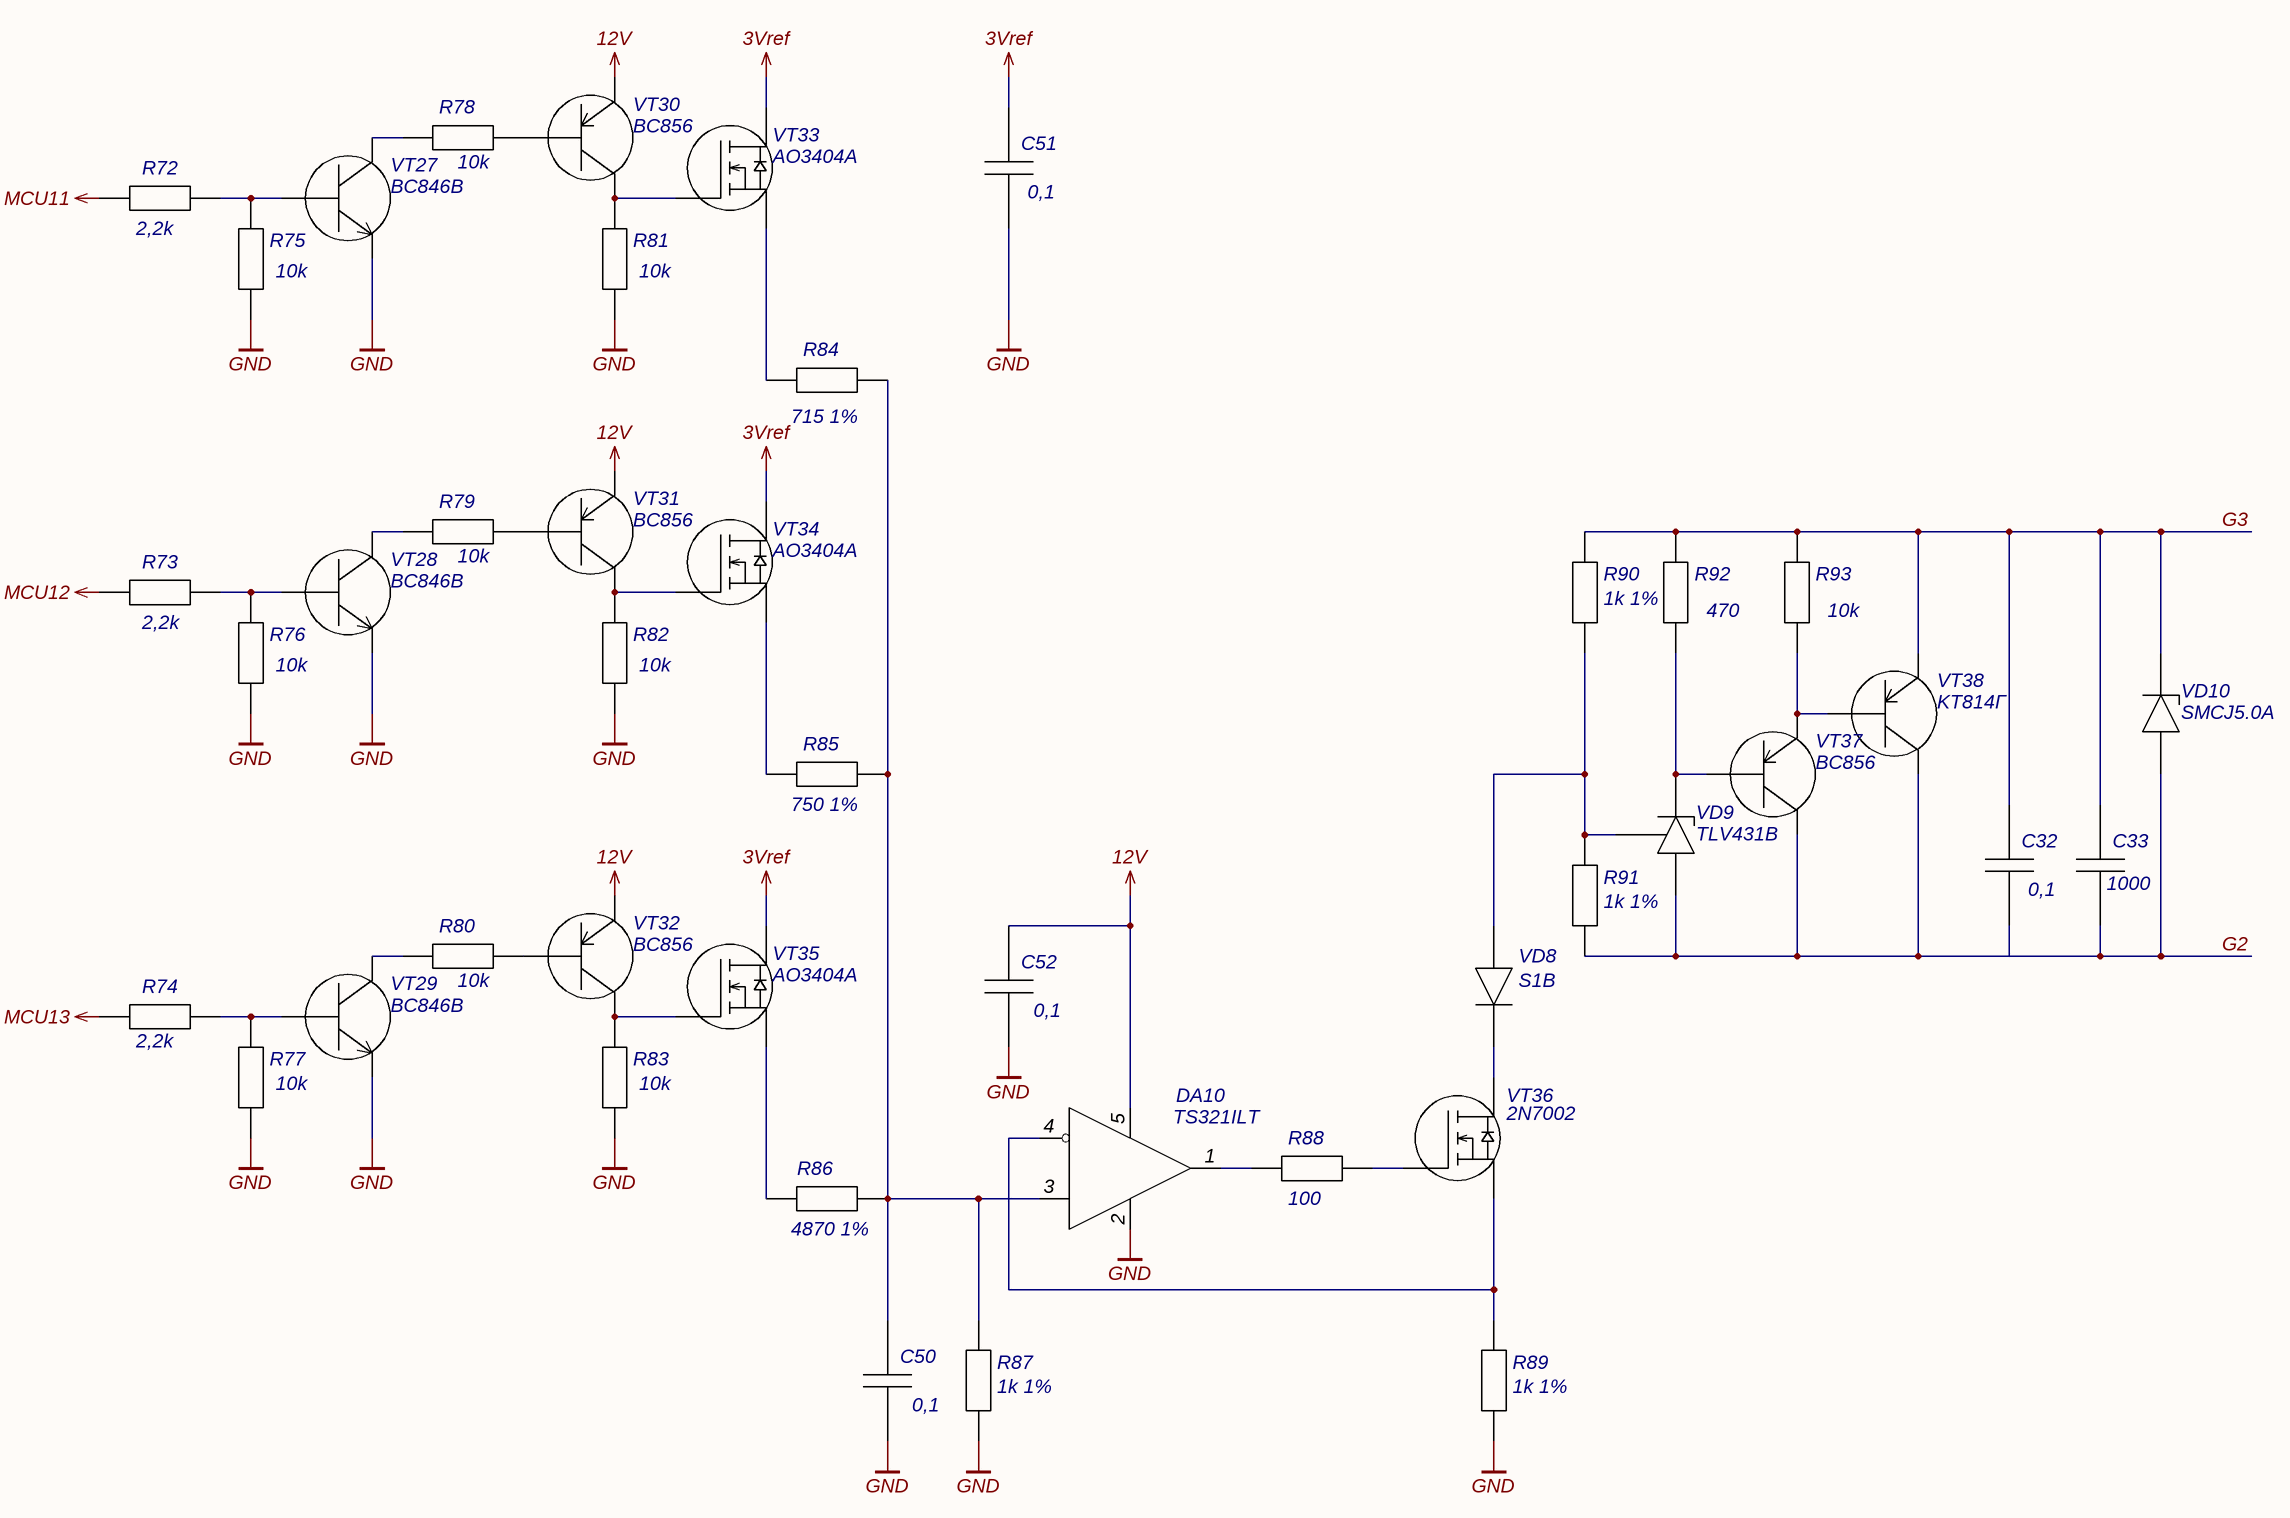
[diagram p7: BI3.SchDoc]

### Parts
C32  0,1  [C0603]
C33  1000  [C0603]
C50  0,1  [C0603]
C51  0,1  [C0603]
C52  0,1  [C0603]
DA10  TS321ILT  [SOT-23-5]
R72  2,2k  [R0603]
R73  2,2k  [R0603]
R74  2,2k  [R0603]
R75  10k  [R0603]
R76  10k  [R0603]
R77  10k  [R0603]
R78  10k  [R0603]
R79  10k  [R0603]
R80  10k  [R0603]
R81  10k  [R0603]
R82  10k  [R0603]
R83  10k  [R0603]
R84  715 1%  [R0603]
R85  750 1%  [R0603]
R86  4870 1%  [R0603]
R87  1k 1%  [R0603]
R88  100  [R0603]
R89  1k 1%  [R0603]
R90  1k 1%  [R0603]
R91  1k 1%  [R0603]
R92  470  [R0603]
R93  10k  [R0603]
VD8  S1B  [DO-214AC]
VD9  TLV431B  [SOT-23]
VD10  SMCJ5.0A  [DO-214AB]
VT27  BC846B  [SOT-23]
VT28  BC846B  [SOT-23]
VT29  BC846B  [SOT-23]
VT30  BC856  [SOT-23]
VT31  BC856  [SOT-23]
VT32  BC856  [SOT-23]
VT33  AO3404A  [SOT-23]
VT34  AO3404A  [SOT-23]
VT35  AO3404A  [SOT-23]
VT36  2N7002  [SOT-23]
VT37  BC856  [SOT-23]
VT38  KT814Г  [TO-126]

### Nets
3Vref: C51.2 VT33.2(D) VT34.2(D) VT35.2(D)
12V: C52.2 DA10.5(Vcc) VT30.1 VT31.1 VT32.1
G2: C32.1 C33.1 R91.1 VD9.1 VD10.1 VT37.2 VT38.2
G3: C32.2 C33.2 R90.2 R92.2 R93.2 VD10.2 VT38.1
GND: C50.1 C51.1 C52.1 DA10.2(GND) R75.1 R76.1 R77.1 R81.1 R82.1 R83.1 R87.1 R89.1 VT27.2(E) VT28.2(E) VT29.2(E)
MCU11: R72.1
MCU12: R73.1
MCU13: R74.1
NetC50_2: C50.2 DA10.3(+) R84.2 R85.2 R86.2 R87.2
NetDA10_1: DA10.1(OUT) R88.1
NetDA10_4: DA10.4(-) R89.2 VT36.3(S)
NetR72_2: R72.2 R75.2 VT27.1(B)
NetR73_2: R73.2 R76.2 VT28.1(B)
NetR74_2: R74.2 R77.2 VT29.1(B)
NetR78_1: R78.1 VT27.3(C)
NetR78_2: R78.2 VT30.3
NetR79_1: R79.1 VT28.3(C)
NetR79_2: R79.2 VT31.3
NetR80_1: R80.1 VT29.3(C)
NetR80_2: R80.2 VT32.3
NetR81_2: R81.2 VT30.2 VT33.1(G)
NetR82_2: R82.2 VT31.2 VT34.1(G)
NetR83_2: R83.2 VT32.2 VT35.1(G)
NetR84_1: R84.1 VT33.3(S)
NetR85_1: R85.1 VT34.3(S)
NetR86_1: R86.1 VT35.3(S)
NetR88_2: R88.2 VT36.1(G)
NetR90_1: R90.1 R91.2 VD8.1 VD9.3
NetR92_1: R92.1 VD9.2 VT37.3
NetR93_1: R93.1 VT37.1 VT38.3
NetVD8_2: VD8.2 VT36.2(D)

### Notes on the sheet
- Подп. и дата
- Инв.№ дубл.
- Взам.инв.№
- Подп.и дата
- Инв.№ подл.
- Изм.
- Лист
- № докум.
- Подп.
- Дата
- Копировал
- Формат  A3

### Library data of the parts
C32 C33 C50-C52 = Chip Capasitor: Чип-конденсатор
  C32 C50-C52: Value: 0,1
  C33: Value: 1000
DA10 = TS321ILT: as DA8 on sheet BI1; Case: SOT-23-5; Name: TS321ILT; Datasheet: https://static.chipdip.ru/lib/710/DOC011710227.pdf
R72-R83 R88 R92 R93 = Chip Resistor: Чип-резистор
  R72-R74: Value: 2,2k
  R75-R83 R93: Value: 10k
  R88: Value: 100
  R92: Value: 470
R84 = Chip Resistor: as R40 on sheet BI1; Value: 715 1%; URL: https://www.chipdip.ru/product0/8002000768
R85 = Chip Resistor: as R41 on sheet BI1; Value: 750 1%; URL: https://www.chipdip.ru/product/0.1w-0603-750-om-1
R86 = Chip Resistor: as R42 on sheet BI1; Value: 4870 1%; URL: https://www.chipdip.ru/product0/8002000679
R87 R89-R91 = Chip Resistor: as R43 on sheet BI1; Value: 1k 1%; URL: https://www.chipdip.ru/product0/8002019285
VD8 = S1B: as VD2 on sheet BI1; Case: DO-214AC; Name: S1B; Datasheet: https://static.chipdip.ru/lib/113/DOC032113174.pdf
VD9 = TLV431B: as VD3 on sheet BI1; Case: SOT-23; Name: TLV431B; Datasheet: https://static.chipdip.ru/lib/985/DOC012985043.pdf
VD10 = SMCJ5.0A: as VD4 on sheet BI1; Case: DO-201; Name: SMCJ5.0A; Datasheet: https://static.chipdip.ru/lib/863/DOC025863760.pdf
VT27-VT29 = BC846B: as VT1 on sheet Mode; Case: SOT-23; Name: BC846B; Datasheet: https://static.chipdip.ru/lib/551/DOC012551042.pdf
VT30-VT32 VT37 = BC856: as VT6 on sheet BI1; Case: SOT-23; Name: BC856; Datasheet: https://static.chipdip.ru/lib/365/DOC004365998.pdf
VT33-VT35 = AO3404A: as VT9 on sheet BI1; Case: SOT-23; Name: AO3404A; Datasheet: https://static.chipdip.ru/lib/906/DOC012906979.pdf
VT36 = 2N7002: as VT12 on sheet BI1; Case: SOT-23; Name: 2N7002; Datasheet: https://static.chipdip.ru/lib/301/DOC021301072.pdf
VT38 = KT814Г: as VT14 on sheet BI1; Case: TO-126; Name: KT814Г; Datasheet: https://static.chipdip.ru/lib/404/DOC047404057.pdf

## Sheet BI4.SchDoc
size 420 x 297 mm; DocumentNumber: 9; SheetNumber: 9; SheetTotal: 13; DecimalNumber: СНАБ.468222.001 ЭЗ
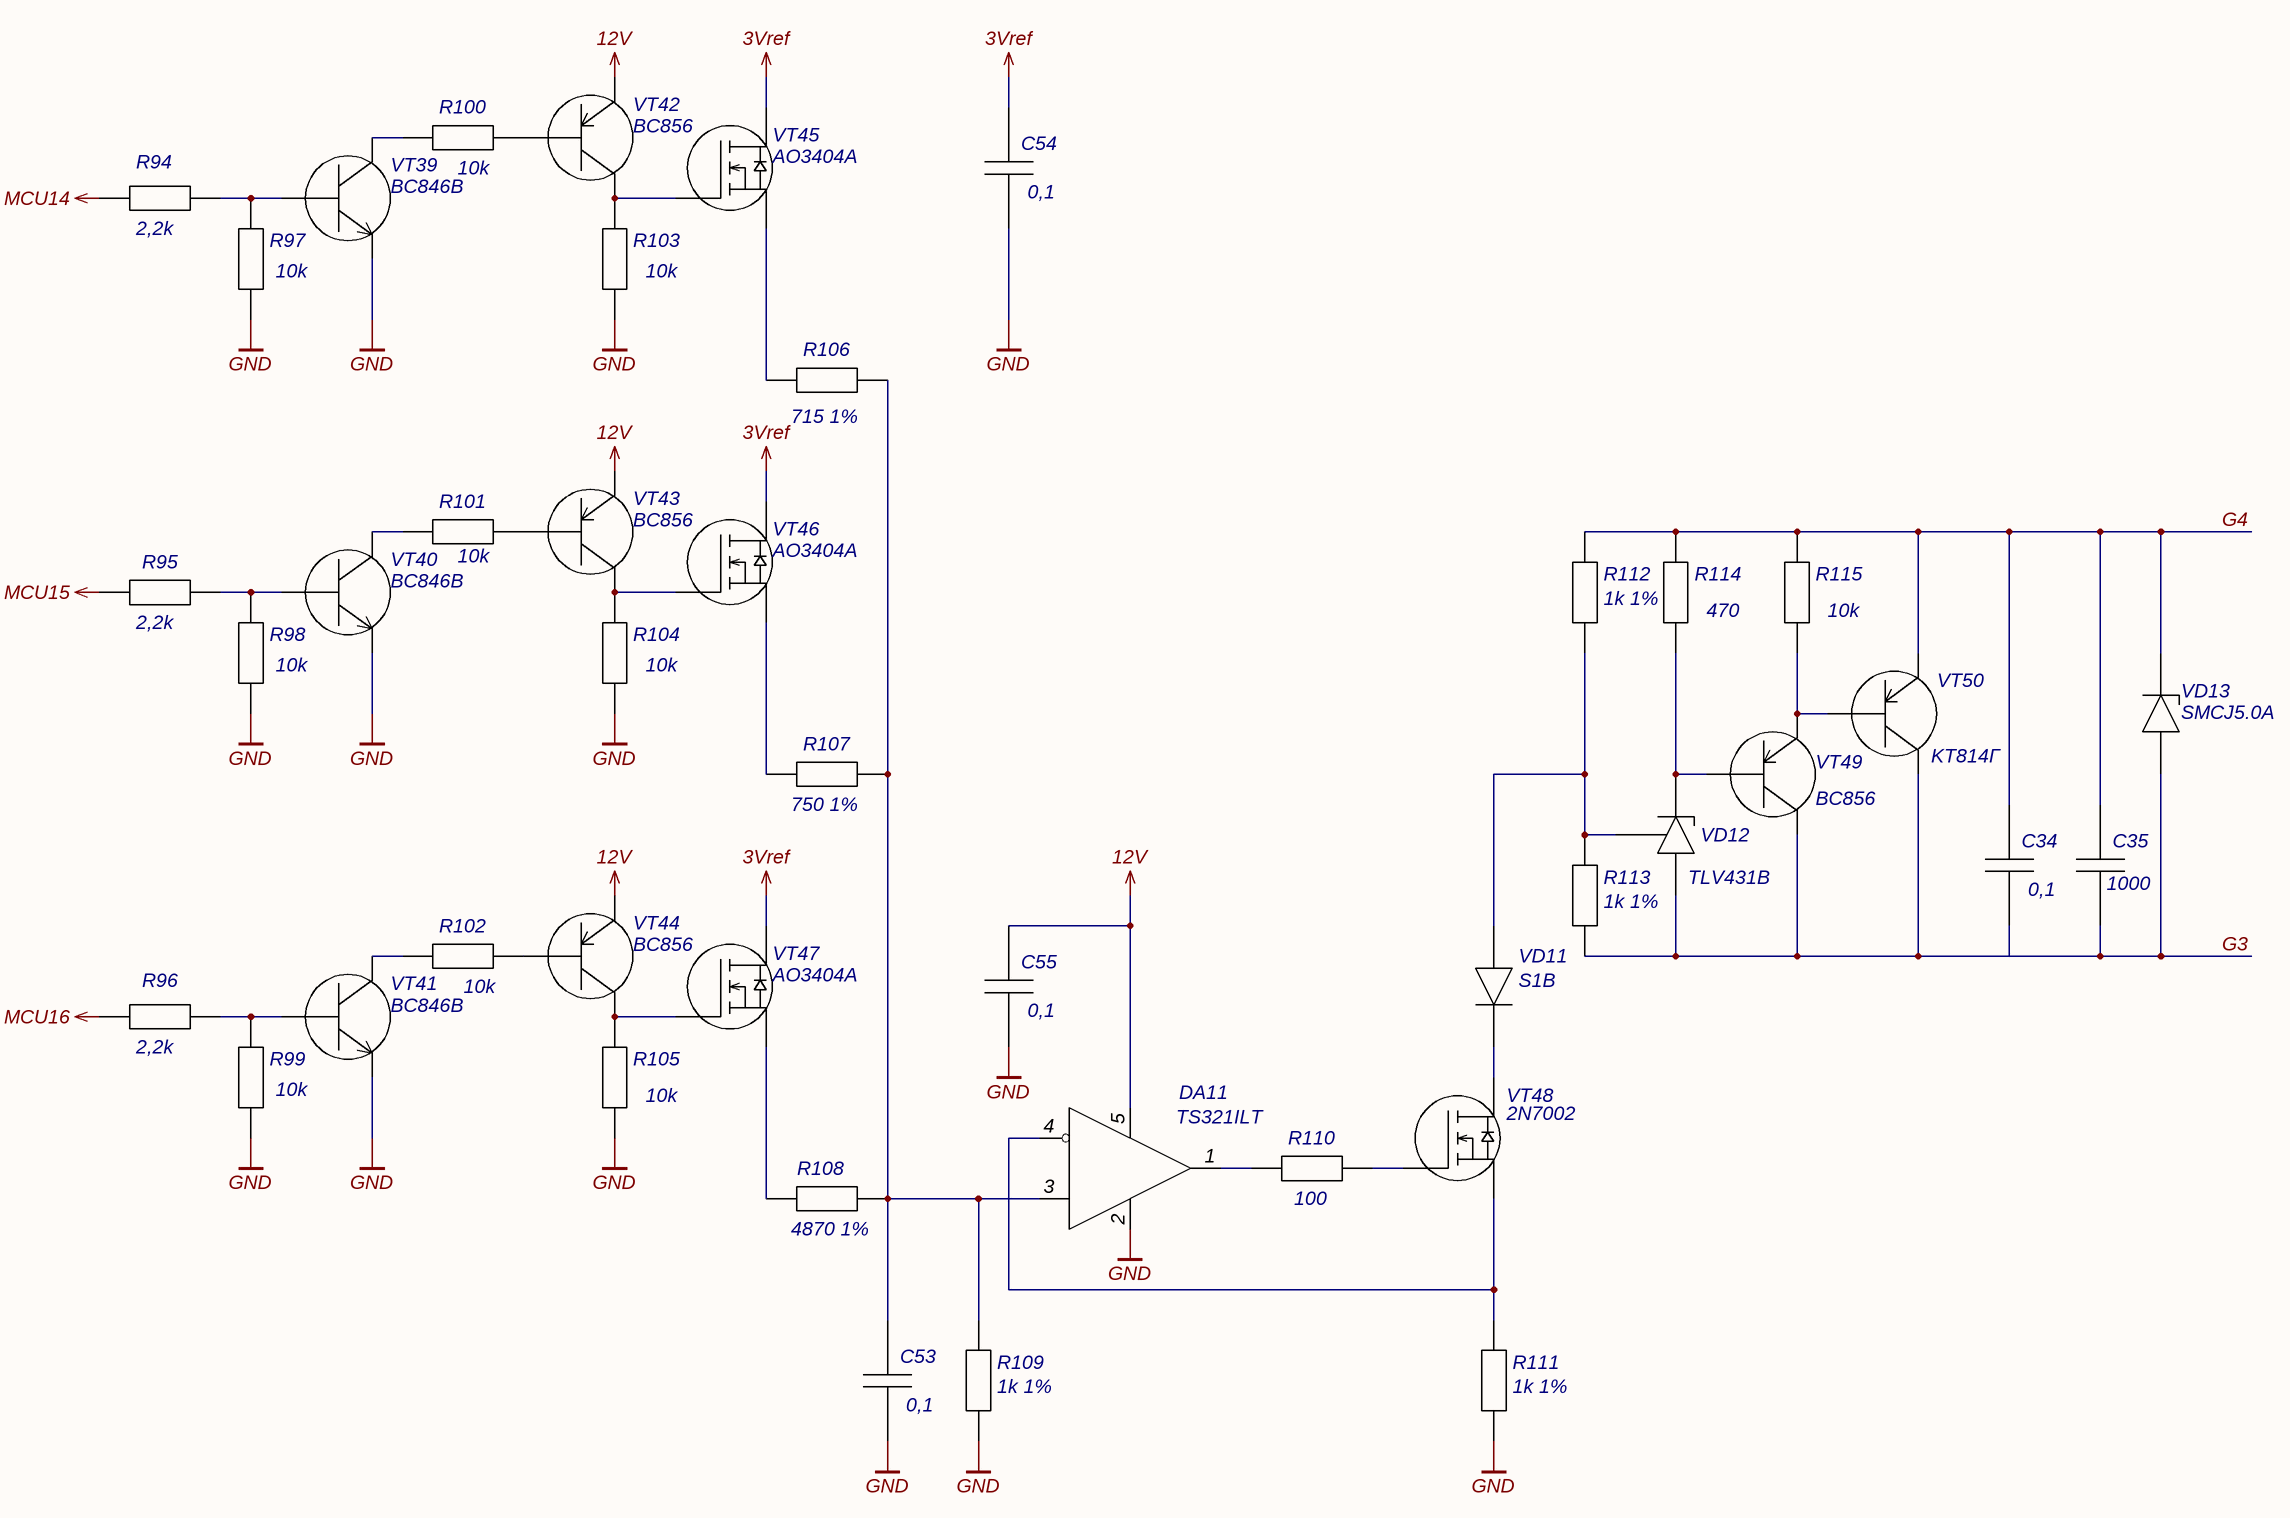
[diagram p8: BI4.SchDoc]

### Parts
C34  0,1  [C0603]
C35  1000  [C0603]
C53  0,1  [C0603]
C54  0,1  [C0603]
C55  0,1  [C0603]
DA11  TS321ILT  [SOT-23-5]
R94  2,2k  [R0603]
R95  2,2k  [R0603]
R96  2,2k  [R0603]
R97  10k  [R0603]
R98  10k  [R0603]
R99  10k  [R0603]
R100  10k  [R0603]
R101  10k  [R0603]
R102  10k  [R0603]
R103  10k  [R0603]
R104  10k  [R0603]
R105  10k  [R0603]
R106  715 1%  [R0603]
R107  750 1%  [R0603]
R108  4870 1%  [R0603]
R109  1k 1%  [R0603]
R110  100  [R0603]
R111  1k 1%  [R0603]
R112  1k 1%  [R0603]
R113  1k 1%  [R0603]
R114  470  [R0603]
R115  10k  [R0603]
VD11  S1B  [DO-214AC]
VD12  TLV431B  [SOT-23]
VD13  SMCJ5.0A  [DO-214AB]
VT39  BC846B  [SOT-23]
VT40  BC846B  [SOT-23]
VT41  BC846B  [SOT-23]
VT42  BC856  [SOT-23]
VT43  BC856  [SOT-23]
VT44  BC856  [SOT-23]
VT45  AO3404A  [SOT-23]
VT46  AO3404A  [SOT-23]
VT47  AO3404A  [SOT-23]
VT48  2N7002  [SOT-23]
VT49  BC856  [SOT-23]
VT50  KT814Г  [TO-126]

### Nets
3Vref: C54.2 VT45.2(D) VT46.2(D) VT47.2(D)
12V: C55.2 DA11.5(Vcc) VT42.1 VT43.1 VT44.1
G3: C34.1 C35.1 R113.1 VD12.1 VD13.1 VT49.2 VT50.2
G4: C34.2 C35.2 R112.2 R114.2 R115.2 VD13.2 VT50.1
GND: C53.1 C54.1 C55.1 DA11.2(GND) R97.1 R98.1 R99.1 R103.1 R104.1 R105.1 R109.1 R111.1 VT39.2(E) VT40.2(E) VT41.2(E)
MCU14: R94.1
MCU15: R95.1
MCU16: R96.1
NetC53_2: C53.2 DA11.3(+) R106.2 R107.2 R108.2 R109.2
NetDA11_1: DA11.1(OUT) R110.1
NetDA11_4: DA11.4(-) R111.2 VT48.3(S)
NetR94_2: R94.2 R97.2 VT39.1(B)
NetR95_2: R95.2 R98.2 VT40.1(B)
NetR96_2: R96.2 R99.2 VT41.1(B)
NetR100_1: R100.1 VT39.3(C)
NetR100_2: R100.2 VT42.3
NetR101_1: R101.1 VT40.3(C)
NetR101_2: R101.2 VT43.3
NetR102_1: R102.1 VT41.3(C)
NetR102_2: R102.2 VT44.3
NetR103_2: R103.2 VT42.2 VT45.1(G)
NetR104_2: R104.2 VT43.2 VT46.1(G)
NetR105_2: R105.2 VT44.2 VT47.1(G)
NetR106_1: R106.1 VT45.3(S)
NetR107_1: R107.1 VT46.3(S)
NetR108_1: R108.1 VT47.3(S)
NetR110_2: R110.2 VT48.1(G)
NetR112_1: R112.1 R113.2 VD11.1 VD12.3
NetR114_1: R114.1 VD12.2 VT49.3
NetR115_1: R115.1 VT49.1 VT50.3
NetVD11_2: VD11.2 VT48.2(D)

### Notes on the sheet
- Подп. и дата
- Инв.№ дубл.
- Взам.инв.№
- Подп.и дата
- Инв.№ подл.
- Изм.
- Лист
- № докум.
- Подп.
- Дата
- Копировал
- Формат  A3

### Library data of the parts
C34 C35 C53-C55 = Chip Capasitor: Чип-конденсатор
  C34 C53-C55: Value: 0,1
  C35: Value: 1000
DA11 = TS321ILT: as DA8 on sheet BI1; Case: SOT-23-5; Name: TS321ILT; Datasheet: https://static.chipdip.ru/lib/710/DOC011710227.pdf
R94-R105 R110 R114 R115 = Chip Resistor: Чип-резистор
  R94-R96: Value: 2,2k
  R97-R105 R115: Value: 10k
  R110: Value: 100
  R114: Value: 470
R106 = Chip Resistor: as R40 on sheet BI1; Value: 715 1%; URL: https://www.chipdip.ru/product0/8002000768
R107 = Chip Resistor: as R41 on sheet BI1; Value: 750 1%; URL: https://www.chipdip.ru/product/0.1w-0603-750-om-1
R108 = Chip Resistor: as R42 on sheet BI1; Value: 4870 1%; URL: https://www.chipdip.ru/product0/8002000679
R109 R111-R113 = Chip Resistor: as R43 on sheet BI1; Value: 1k 1%; URL: https://www.chipdip.ru/product0/8002019285
VD11 = S1B: as VD2 on sheet BI1; Case: DO-214AC; Name: S1B; Datasheet: https://static.chipdip.ru/lib/113/DOC032113174.pdf
VD12 = TLV431B: as VD3 on sheet BI1; Case: SOT-23; Name: TLV431B; Datasheet: https://static.chipdip.ru/lib/985/DOC012985043.pdf
VD13 = SMCJ5.0A: as VD4 on sheet BI1; Case: DO-201; Name: SMCJ5.0A; Datasheet: https://static.chipdip.ru/lib/863/DOC025863760.pdf
VT39-VT41 = BC846B: as VT1 on sheet Mode; Case: SOT-23; Name: BC846B; Datasheet: https://static.chipdip.ru/lib/551/DOC012551042.pdf
VT42-VT44 VT49 = BC856: as VT6 on sheet BI1; Case: SOT-23; Name: BC856; Datasheet: https://static.chipdip.ru/lib/365/DOC004365998.pdf
VT45-VT47 = AO3404A: as VT9 on sheet BI1; Case: SOT-23; Name: AO3404A; Datasheet: https://static.chipdip.ru/lib/906/DOC012906979.pdf
VT48 = 2N7002: as VT12 on sheet BI1; Case: SOT-23; Name: 2N7002; Datasheet: https://static.chipdip.ru/lib/301/DOC021301072.pdf
VT50 = KT814Г: as VT14 on sheet BI1; Case: TO-126; Name: KT814Г; Datasheet: https://static.chipdip.ru/lib/404/DOC047404057.pdf

## Sheet BI5.SchDoc
size 420 x 297 mm; DocumentNumber: 10; SheetNumber: 10; SheetTotal: 13; DecimalNumber: СНАБ.468222.001 ЭЗ
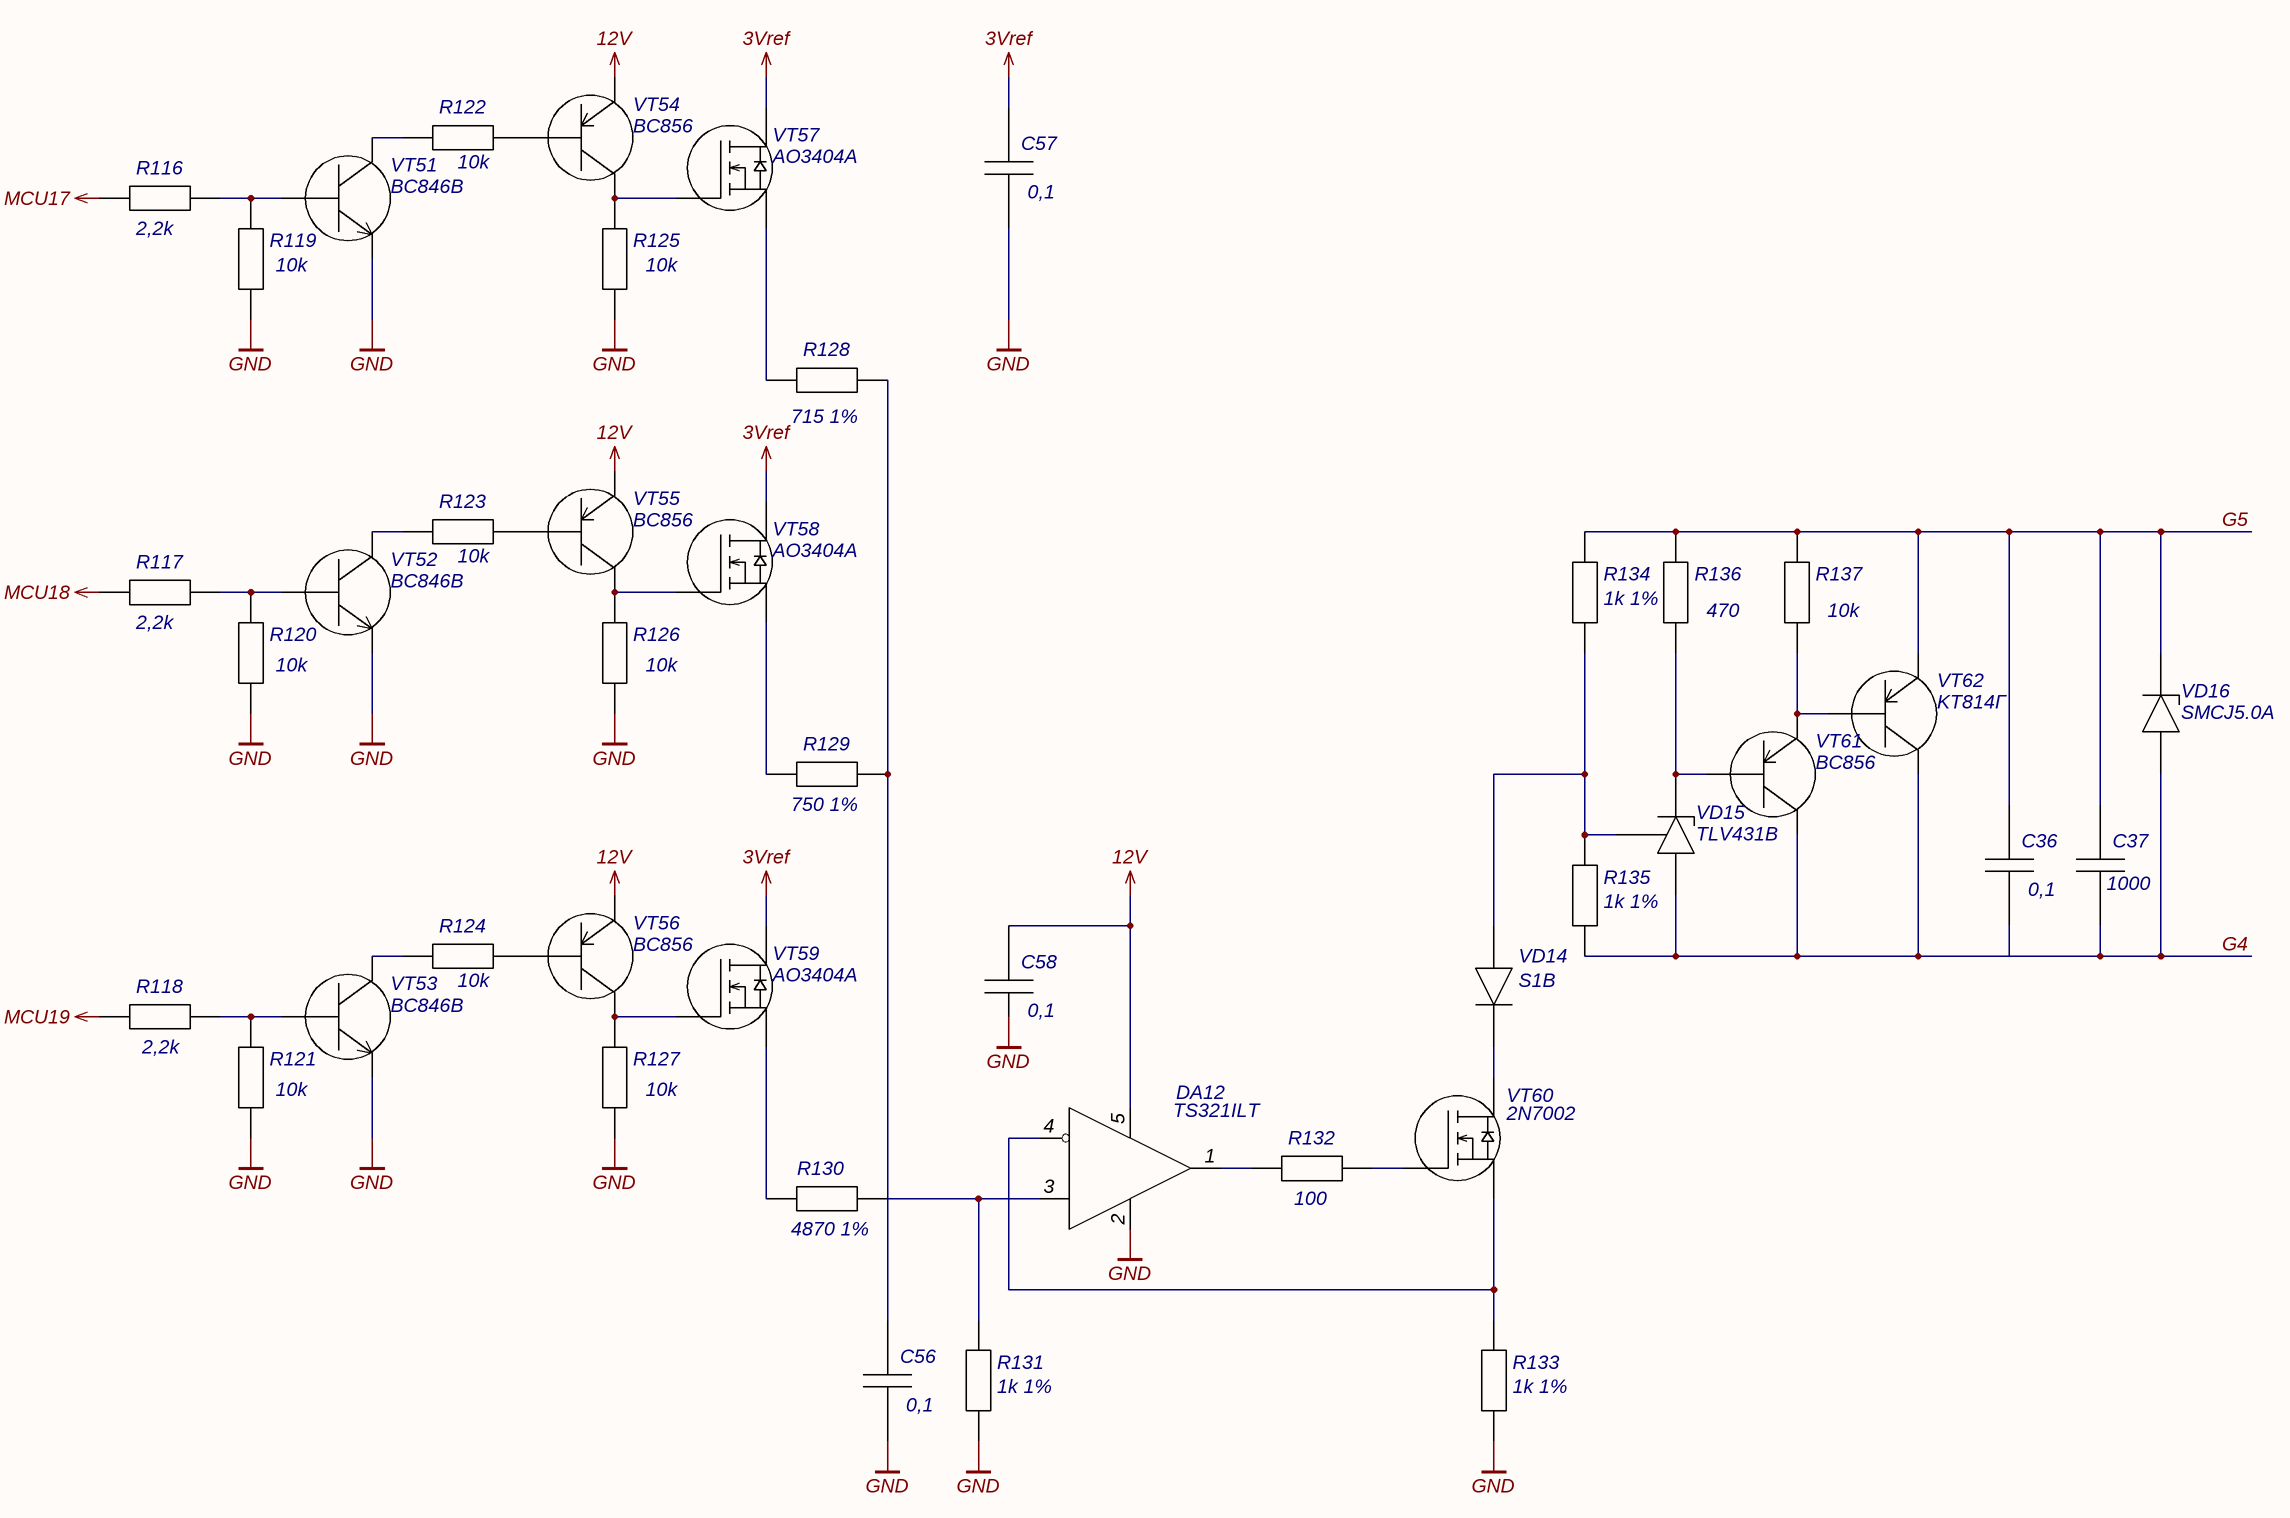
[diagram p9: BI5.SchDoc]

### Parts
C36  0,1  [C0603]
C37  1000  [C0603]
C56  0,1  [C0603]
C57  0,1  [C0603]
C58  0,1  [C0603]
DA12  TS321ILT  [SOT-23-5]
R116  2,2k  [R0603]
R117  2,2k  [R0603]
R118  2,2k  [R0603]
R119  10k  [R0603]
R120  10k  [R0603]
R121  10k  [R0603]
R122  10k  [R0603]
R123  10k  [R0603]
R124  10k  [R0603]
R125  10k  [R0603]
R126  10k  [R0603]
R127  10k  [R0603]
R128  715 1%  [R0603]
R129  750 1%  [R0603]
R130  4870 1%  [R0603]
R131  1k 1%  [R0603]
R132  100  [R0603]
R133  1k 1%  [R0603]
R134  1k 1%  [R0603]
R135  1k 1%  [R0603]
R136  470  [R0603]
R137  10k  [R0603]
VD14  S1B  [DO-214AC]
VD15  TLV431B  [SOT-23]
VD16  SMCJ5.0A  [DO-214AB]
VT51  BC846B  [SOT-23]
VT52  BC846B  [SOT-23]
VT53  BC846B  [SOT-23]
VT54  BC856  [SOT-23]
VT55  BC856  [SOT-23]
VT56  BC856  [SOT-23]
VT57  AO3404A  [SOT-23]
VT58  AO3404A  [SOT-23]
VT59  AO3404A  [SOT-23]
VT60  2N7002  [SOT-23]
VT61  BC856  [SOT-23]
VT62  KT814Г  [TO-126]

### Nets
3Vref: C57.2 VT57.2(D) VT58.2(D) VT59.2(D)
12V: C58.2 DA12.5(Vcc) VT54.1 VT55.1 VT56.1
G4: C36.1 C37.1 R135.1 VD15.1 VD16.1 VT61.2 VT62.2
G5: C36.2 C37.2 R134.2 R136.2 R137.2 VD16.2 VT62.1
GND: C56.1 C57.1 DA12.2(GND) R119.1 R120.1 R121.1 R125.1 R126.1 R127.1 R131.1 R133.1 VT51.2(E) VT52.2(E) VT53.2(E)
MCU17: R116.1
MCU18: R117.1
MCU19: R118.1
NetC56_2: C56.2 DA12.3(+) R128.2 R129.2 R130.2 R131.2
NetDA12_1: DA12.1(OUT) R132.1
NetDA12_4: DA12.4(-) R133.2 VT60.3(S)
NetR116_2: R116.2 R119.2 VT51.1(B)
NetR117_2: R117.2 R120.2 VT52.1(B)
NetR118_2: R118.2 R121.2 VT53.1(B)
NetR122_1: R122.1 VT51.3(C)
NetR122_2: R122.2 VT54.3
NetR123_1: R123.1 VT52.3(C)
NetR123_2: R123.2 VT55.3
NetR124_1: R124.1 VT53.3(C)
NetR124_2: R124.2 VT56.3
NetR125_2: R125.2 VT54.2 VT57.1(G)
NetR126_2: R126.2 VT55.2 VT58.1(G)
NetR127_2: R127.2 VT56.2 VT59.1(G)
NetR128_1: R128.1 VT57.3(S)
NetR129_1: R129.1 VT58.3(S)
NetR130_1: R130.1 VT59.3(S)
NetR132_2: R132.2 VT60.1(G)
NetR134_1: R134.1 R135.2 VD14.1 VD15.3
NetR136_1: R136.1 VD15.2 VT61.3
NetR137_1: R137.1 VT61.1 VT62.3
NetVD14_2: VD14.2 VT60.2(D)

Not connected (* = marked no-connect by the designer): C58 1

### Notes on the sheet
- Labels drawn without touching a wire or pin: GND
- Подп. и дата
- Инв.№ дубл.
- Взам.инв.№
- Подп.и дата
- Инв.№ подл.
- Изм.
- Лист
- № докум.
- Подп.
- Дата
- Копировал
- Формат  A3

### Library data of the parts
C36 C37 C56-C58 = Chip Capasitor: Чип-конденсатор
  C36 C56-C58: Value: 0,1
  C37: Value: 1000
DA12 = TS321ILT: as DA8 on sheet BI1; Case: SOT-23-5; Name: TS321ILT; Datasheet: https://static.chipdip.ru/lib/710/DOC011710227.pdf
R116-R127 R132 R136 R137 = Chip Resistor: Чип-резистор
  R116-R118: Value: 2,2k
  R119-R127 R137: Value: 10k
  R132: Value: 100
  R136: Value: 470
R128 = Chip Resistor: as R40 on sheet BI1; Value: 715 1%; URL: https://www.chipdip.ru/product0/8002000768
R129 = Chip Resistor: as R41 on sheet BI1; Value: 750 1%; URL: https://www.chipdip.ru/product/0.1w-0603-750-om-1
R130 = Chip Resistor: as R42 on sheet BI1; Value: 4870 1%; URL: https://www.chipdip.ru/product0/8002000679
R131 R133-R135 = Chip Resistor: as R43 on sheet BI1; Value: 1k 1%; URL: https://www.chipdip.ru/product0/8002019285
VD14 = S1B: as VD2 on sheet BI1; Case: DO-214AC; Name: S1B; Datasheet: https://static.chipdip.ru/lib/113/DOC032113174.pdf
VD15 = TLV431B: as VD3 on sheet BI1; Case: SOT-23; Name: TLV431B; Datasheet: https://static.chipdip.ru/lib/985/DOC012985043.pdf
VD16 = SMCJ5.0A: as VD4 on sheet BI1; Case: DO-201; Name: SMCJ5.0A; Datasheet: https://static.chipdip.ru/lib/863/DOC025863760.pdf
VT51-VT53 = BC846B: as VT1 on sheet Mode; Case: SOT-23; Name: BC846B; Datasheet: https://static.chipdip.ru/lib/551/DOC012551042.pdf
VT54-VT56 VT61 = BC856: as VT6 on sheet BI1; Case: SOT-23; Name: BC856; Datasheet: https://static.chipdip.ru/lib/365/DOC004365998.pdf
VT57-VT59 = AO3404A: as VT9 on sheet BI1; Case: SOT-23; Name: AO3404A; Datasheet: https://static.chipdip.ru/lib/906/DOC012906979.pdf
VT60 = 2N7002: as VT12 on sheet BI1; Case: SOT-23; Name: 2N7002; Datasheet: https://static.chipdip.ru/lib/301/DOC021301072.pdf
VT62 = KT814Г: as VT14 on sheet BI1; Case: TO-126; Name: KT814Г; Datasheet: https://static.chipdip.ru/lib/404/DOC047404057.pdf

## Sheet BI6.SchDoc
size 420 x 297 mm; DocumentNumber: 11; SheetNumber: 11; SheetTotal: 13; DecimalNumber: СНАБ.468222.001 ЭЗ
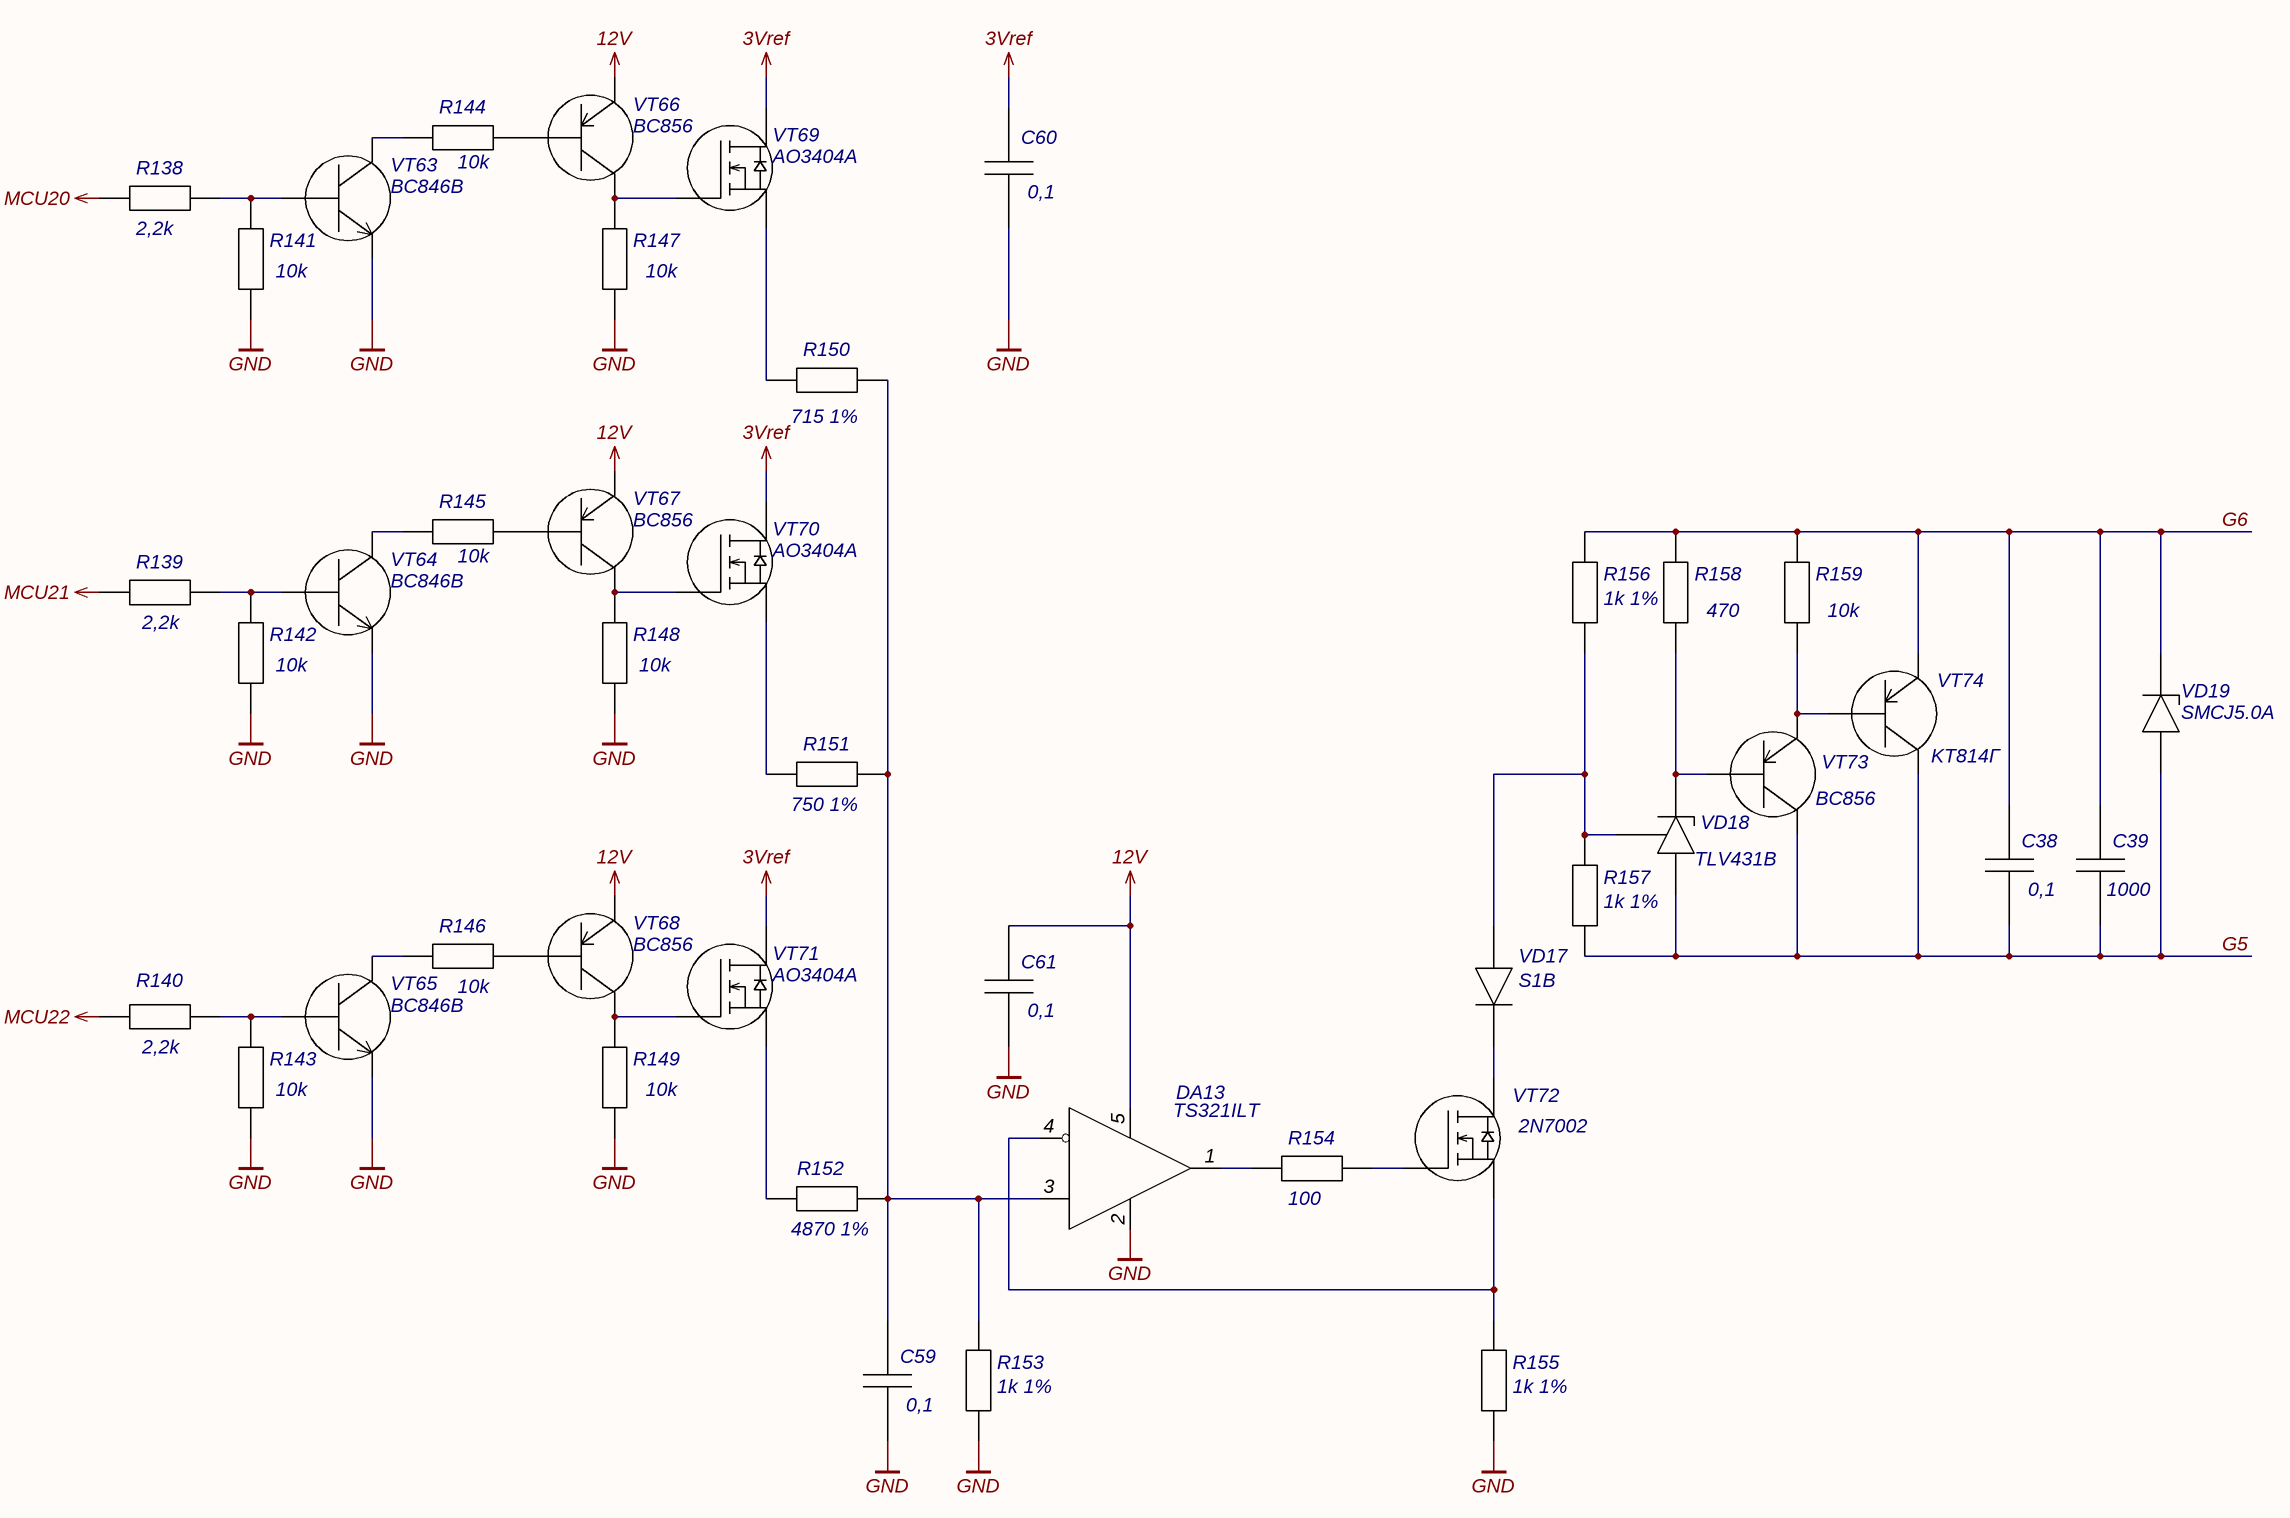
[diagram p10: BI6.SchDoc]

### Parts
C38  0,1  [C0603]
C39  1000  [C0603]
C59  0,1  [C0603]
C60  0,1  [C0603]
C61  0,1  [C0603]
DA13  TS321ILT  [SOT-23-5]
R138  2,2k  [R0603]
R139  2,2k  [R0603]
R140  2,2k  [R0603]
R141  10k  [R0603]
R142  10k  [R0603]
R143  10k  [R0603]
R144  10k  [R0603]
R145  10k  [R0603]
R146  10k  [R0603]
R147  10k  [R0603]
R148  10k  [R0603]
R149  10k  [R0603]
R150  715 1%  [R0603]
R151  750 1%  [R0603]
R152  4870 1%  [R0603]
R153  1k 1%  [R0603]
R154  100  [R0603]
R155  1k 1%  [R0603]
R156  1k 1%  [R0603]
R157  1k 1%  [R0603]
R158  470  [R0603]
R159  10k  [R0603]
VD17  S1B  [DO-214AC]
VD18  TLV431B  [SOT-23]
VD19  SMCJ5.0A  [DO-214AB]
VT63  BC846B  [SOT-23]
VT64  BC846B  [SOT-23]
VT65  BC846B  [SOT-23]
VT66  BC856  [SOT-23]
VT67  BC856  [SOT-23]
VT68  BC856  [SOT-23]
VT69  AO3404A  [SOT-23]
VT70  AO3404A  [SOT-23]
VT71  AO3404A  [SOT-23]
VT72  2N7002  [SOT-23]
VT73  BC856  [SOT-23]
VT74  KT814Г  [TO-126]

### Nets
3Vref: C60.2 VT69.2(D) VT70.2(D) VT71.2(D)
12V: C61.2 DA13.5(Vcc) VT66.1 VT67.1 VT68.1
G5: C38.1 C39.1 R157.1 VD18.1 VD19.1 VT73.2 VT74.2
G6: C38.2 C39.2 R156.2 R158.2 R159.2 VD19.2 VT74.1
GND: C59.1 C60.1 C61.1 DA13.2(GND) R141.1 R142.1 R143.1 R147.1 R148.1 R149.1 R153.1 R155.1 VT63.2(E) VT64.2(E) VT65.2(E)
MCU20: R138.1
MCU21: R139.1
MCU22: R140.1
NetC59_2: C59.2 DA13.3(+) R150.2 R151.2 R152.2 R153.2
NetDA13_1: DA13.1(OUT) R154.1
NetDA13_4: DA13.4(-) R155.2 VT72.3(S)
NetR138_2: R138.2 R141.2 VT63.1(B)
NetR139_2: R139.2 R142.2 VT64.1(B)
NetR140_2: R140.2 R143.2 VT65.1(B)
NetR144_1: R144.1 VT63.3(C)
NetR144_2: R144.2 VT66.3
NetR145_1: R145.1 VT64.3(C)
NetR145_2: R145.2 VT67.3
NetR146_1: R146.1 VT65.3(C)
NetR146_2: R146.2 VT68.3
NetR147_2: R147.2 VT66.2 VT69.1(G)
NetR148_2: R148.2 VT67.2 VT70.1(G)
NetR149_2: R149.2 VT68.2 VT71.1(G)
NetR150_1: R150.1 VT69.3(S)
NetR151_1: R151.1 VT70.3(S)
NetR152_1: R152.1 VT71.3(S)
NetR154_2: R154.2 VT72.1(G)
NetR156_1: R156.1 R157.2 VD17.1 VD18.3
NetR158_1: R158.1 VD18.2 VT73.3
NetR159_1: R159.1 VT73.1 VT74.3
NetVD17_2: VD17.2 VT72.2(D)

### Notes on the sheet
- Подп. и дата
- Инв.№ дубл.
- Взам.инв.№
- Подп.и дата
- Инв.№ подл.
- Изм.
- Лист
- № докум.
- Подп.
- Дата
- Копировал
- Формат  A3

### Library data of the parts
C38 C39 C59-C61 = Chip Capasitor: Чип-конденсатор
  C38 C59-C61: Value: 0,1
  C39: Value: 1000
DA13 = TS321ILT: as DA8 on sheet BI1; Case: SOT-23-5; Name: TS321ILT; Datasheet: https://static.chipdip.ru/lib/710/DOC011710227.pdf
R138-R149 R154 R158 R159 = Chip Resistor: Чип-резистор
  R138-R140: Value: 2,2k
  R141-R149 R159: Value: 10k
  R154: Value: 100
  R158: Value: 470
R150 = Chip Resistor: as R40 on sheet BI1; Value: 715 1%; URL: https://www.chipdip.ru/product0/8002000768
R151 = Chip Resistor: as R41 on sheet BI1; Value: 750 1%; URL: https://www.chipdip.ru/product/0.1w-0603-750-om-1
R152 = Chip Resistor: as R42 on sheet BI1; Value: 4870 1%; URL: https://www.chipdip.ru/product0/8002000679
R153 R155-R157 = Chip Resistor: as R43 on sheet BI1; Value: 1k 1%; URL: https://www.chipdip.ru/product0/8002019285
VD17 = S1B: as VD2 on sheet BI1; Case: DO-214AC; Name: S1B; Datasheet: https://static.chipdip.ru/lib/113/DOC032113174.pdf
VD18 = TLV431B: as VD3 on sheet BI1; Case: SOT-23; Name: TLV431B; Datasheet: https://static.chipdip.ru/lib/985/DOC012985043.pdf
VD19 = SMCJ5.0A: as VD4 on sheet BI1; Case: DO-201; Name: SMCJ5.0A; Datasheet: https://static.chipdip.ru/lib/863/DOC025863760.pdf
VT63-VT65 = BC846B: as VT1 on sheet Mode; Case: SOT-23; Name: BC846B; Datasheet: https://static.chipdip.ru/lib/551/DOC012551042.pdf
VT66-VT68 VT73 = BC856: as VT6 on sheet BI1; Case: SOT-23; Name: BC856; Datasheet: https://static.chipdip.ru/lib/365/DOC004365998.pdf
VT69-VT71 = AO3404A: as VT9 on sheet BI1; Case: SOT-23; Name: AO3404A; Datasheet: https://static.chipdip.ru/lib/906/DOC012906979.pdf
VT72 = 2N7002: as VT12 on sheet BI1; Case: SOT-23; Name: 2N7002; Datasheet: https://static.chipdip.ru/lib/301/DOC021301072.pdf
VT74 = KT814Г: as VT14 on sheet BI1; Case: TO-126; Name: KT814Г; Datasheet: https://static.chipdip.ru/lib/404/DOC047404057.pdf

## Sheet BI7.SchDoc
size 420 x 297 mm; DocumentNumber: 12; SheetNumber: 12; SheetTotal: 13; DecimalNumber: СНАБ.468222.001 ЭЗ
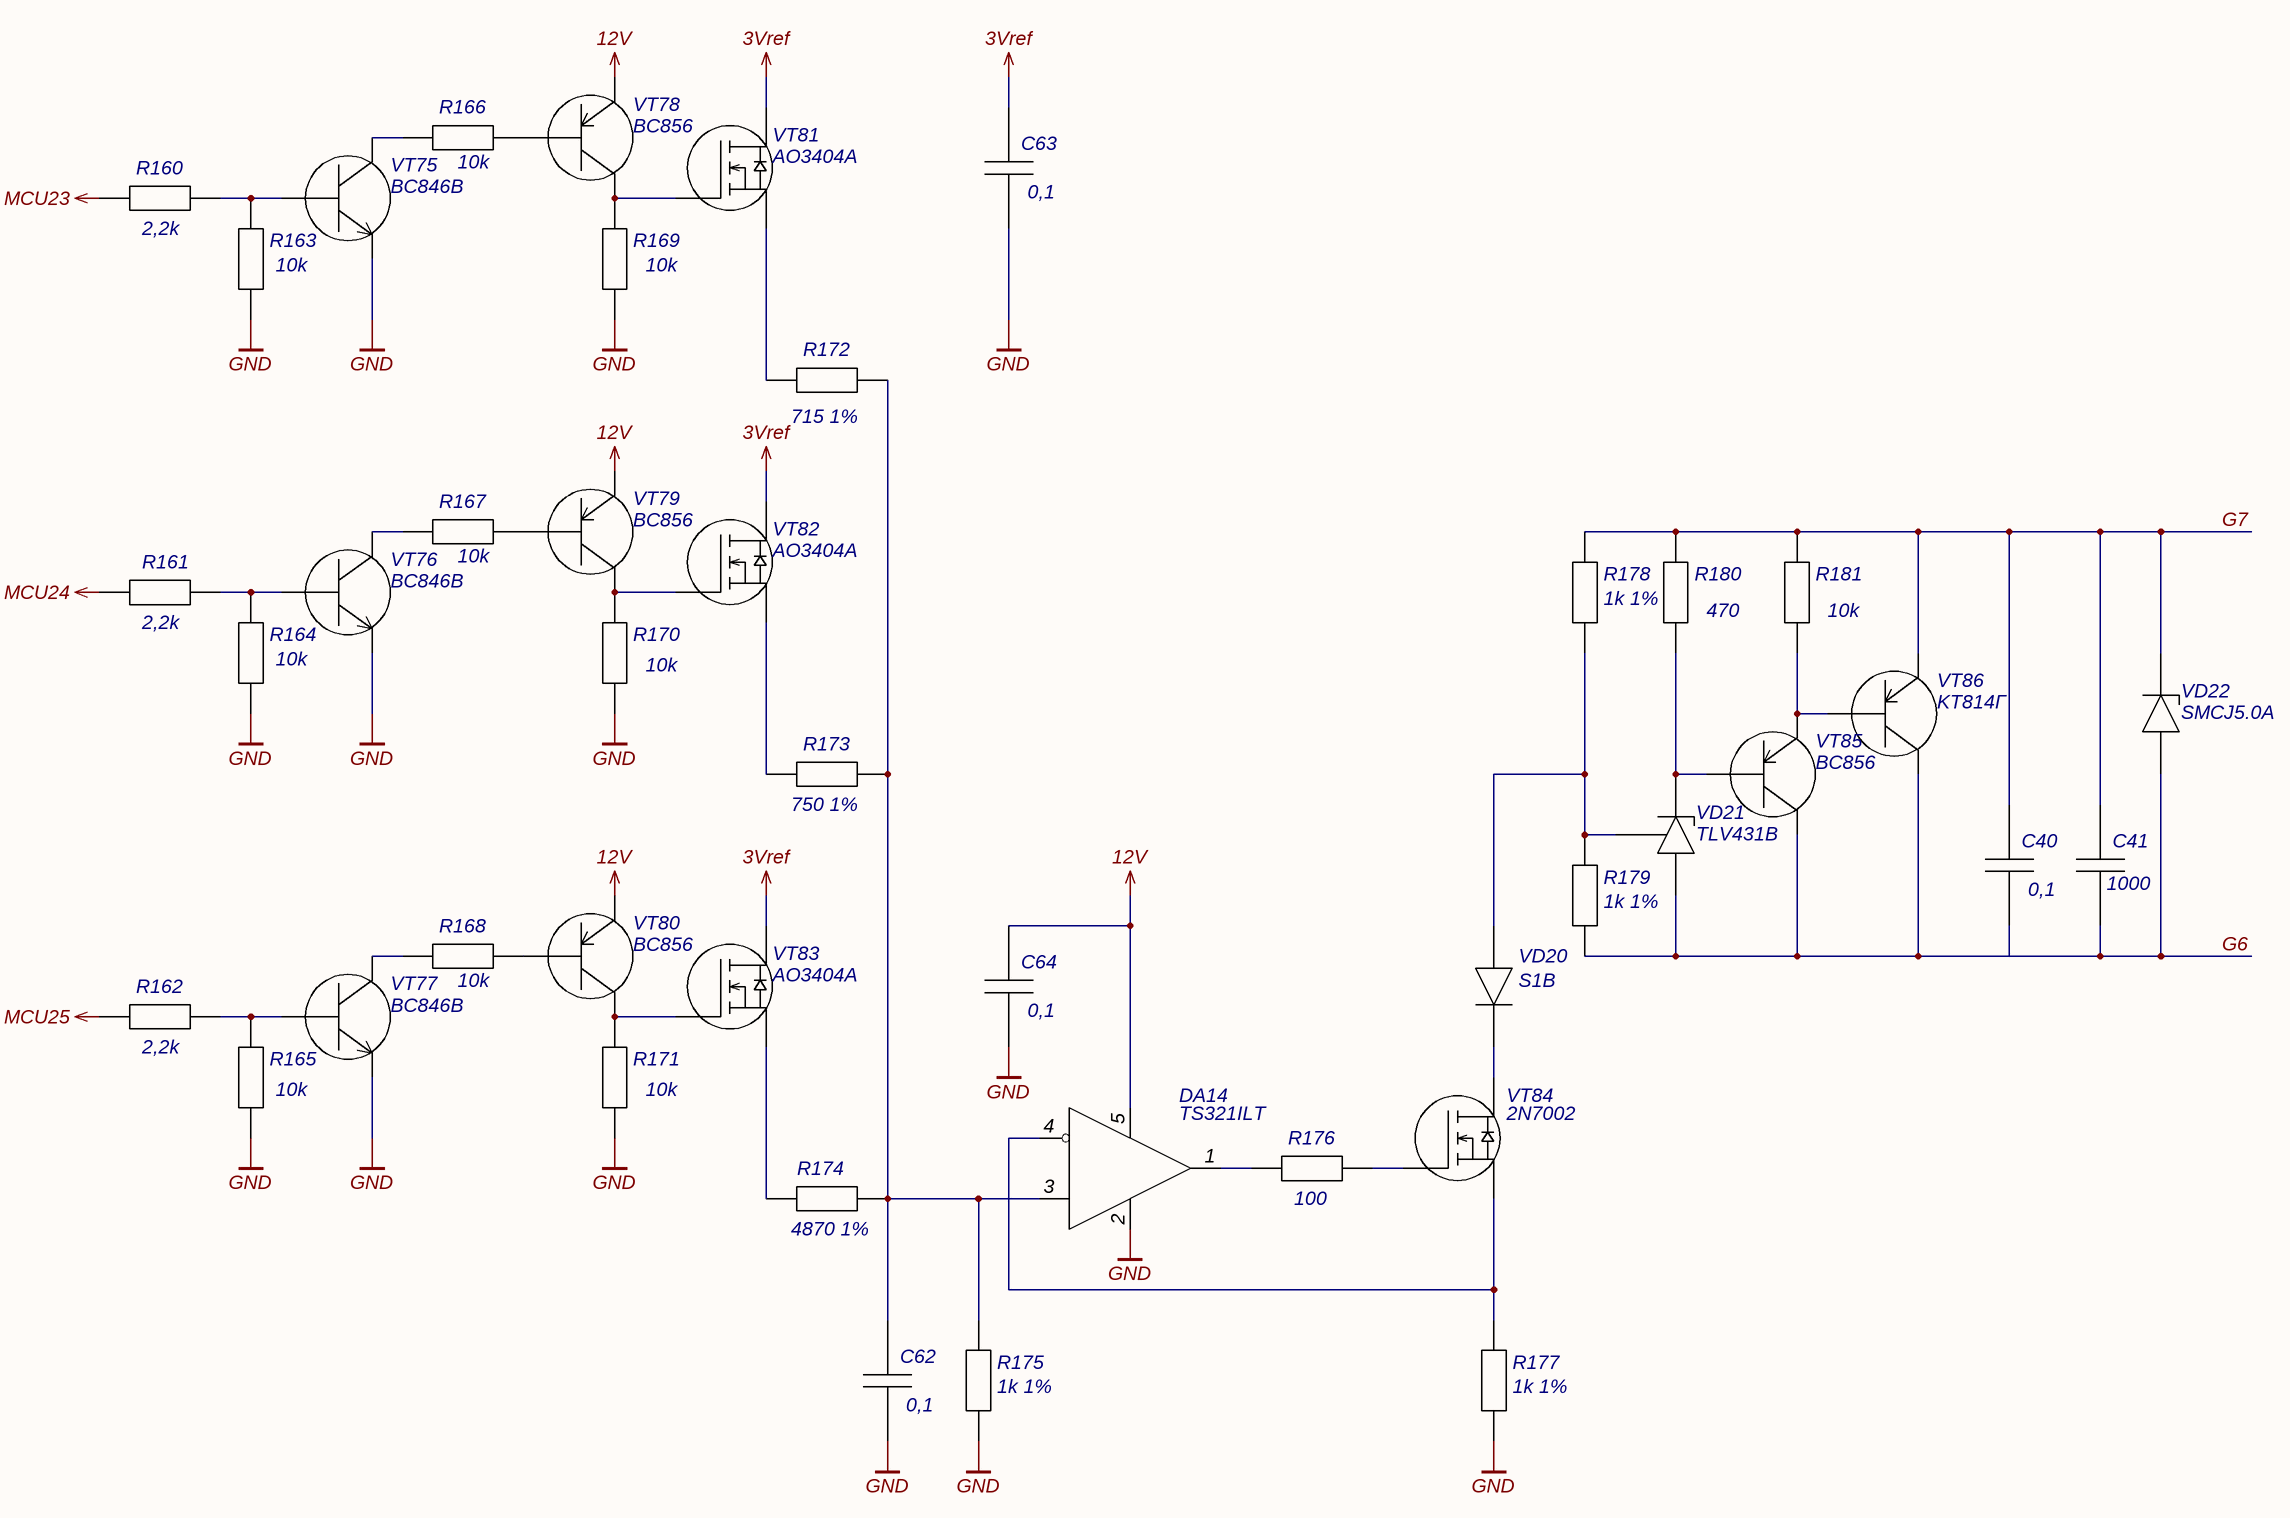
[diagram p11: BI7.SchDoc]

### Parts
C40  0,1  [C0603]
C41  1000  [C0603]
C62  0,1  [C0603]
C63  0,1  [C0603]
C64  0,1  [C0603]
DA14  TS321ILT  [SOT-23-5]
R160  2,2k  [R0603]
R161  2,2k  [R0603]
R162  2,2k  [R0603]
R163  10k  [R0603]
R164  10k  [R0603]
R165  10k  [R0603]
R166  10k  [R0603]
R167  10k  [R0603]
R168  10k  [R0603]
R169  10k  [R0603]
R170  10k  [R0603]
R171  10k  [R0603]
R172  715 1%  [R0603]
R173  750 1%  [R0603]
R174  4870 1%  [R0603]
R175  1k 1%  [R0603]
R176  100  [R0603]
R177  1k 1%  [R0603]
R178  1k 1%  [R0603]
R179  1k 1%  [R0603]
R180  470  [R0603]
R181  10k  [R0603]
VD20  S1B  [DO-214AC]
VD21  TLV431B  [SOT-23]
VD22  SMCJ5.0A  [DO-214AB]
VT75  BC846B  [SOT-23]
VT76  BC846B  [SOT-23]
VT77  BC846B  [SOT-23]
VT78  BC856  [SOT-23]
VT79  BC856  [SOT-23]
VT80  BC856  [SOT-23]
VT81  AO3404A  [SOT-23]
VT82  AO3404A  [SOT-23]
VT83  AO3404A  [SOT-23]
VT84  2N7002  [SOT-23]
VT85  BC856  [SOT-23]
VT86  KT814Г  [TO-126]

### Nets
3Vref: C63.2 VT81.2(D) VT82.2(D) VT83.2(D)
12V: C64.2 DA14.5(Vcc) VT78.1 VT79.1 VT80.1
G6: C40.1 C41.1 R179.1 VD21.1 VD22.1 VT85.2 VT86.2
G7: C40.2 C41.2 R178.2 R180.2 R181.2 VD22.2 VT86.1
GND: C62.1 C63.1 C64.1 DA14.2(GND) R163.1 R164.1 R165.1 R169.1 R170.1 R171.1 R175.1 R177.1 VT75.2(E) VT76.2(E) VT77.2(E)
MCU23: R160.1
MCU24: R161.1
MCU25: R162.1
NetC62_2: C62.2 DA14.3(+) R172.2 R173.2 R174.2 R175.2
NetDA14_1: DA14.1(OUT) R176.1
NetDA14_4: DA14.4(-) R177.2 VT84.3(S)
NetR160_2: R160.2 R163.2 VT75.1(B)
NetR161_2: R161.2 R164.2 VT76.1(B)
NetR162_2: R162.2 R165.2 VT77.1(B)
NetR166_1: R166.1 VT75.3(C)
NetR166_2: R166.2 VT78.3
NetR167_1: R167.1 VT76.3(C)
NetR167_2: R167.2 VT79.3
NetR168_1: R168.1 VT77.3(C)
NetR168_2: R168.2 VT80.3
NetR169_2: R169.2 VT78.2 VT81.1(G)
NetR170_2: R170.2 VT79.2 VT82.1(G)
NetR171_2: R171.2 VT80.2 VT83.1(G)
NetR172_1: R172.1 VT81.3(S)
NetR173_1: R173.1 VT82.3(S)
NetR174_1: R174.1 VT83.3(S)
NetR176_2: R176.2 VT84.1(G)
NetR178_1: R178.1 R179.2 VD20.1 VD21.3
NetR180_1: R180.1 VD21.2 VT85.3
NetR181_1: R181.1 VT85.1 VT86.3
NetVD20_2: VD20.2 VT84.2(D)

### Notes on the sheet
- Подп. и дата
- Инв.№ дубл.
- Взам.инв.№
- Подп.и дата
- Инв.№ подл.
- Изм.
- Лист
- № докум.
- Подп.
- Дата
- Копировал
- Формат  A3

### Library data of the parts
C40 C41 C62-C64 = Chip Capasitor: Чип-конденсатор
  C40 C62-C64: Value: 0,1
  C41: Value: 1000
DA14 = TS321ILT: as DA8 on sheet BI1; Case: SOT-23-5; Name: TS321ILT; Datasheet: https://static.chipdip.ru/lib/710/DOC011710227.pdf
R160-R171 R176 R180 R181 = Chip Resistor: Чип-резистор
  R160-R162: Value: 2,2k
  R163-R171 R181: Value: 10k
  R176: Value: 100
  R180: Value: 470
R172 = Chip Resistor: as R40 on sheet BI1; Value: 715 1%; URL: https://www.chipdip.ru/product0/8002000768
R173 = Chip Resistor: as R41 on sheet BI1; Value: 750 1%; URL: https://www.chipdip.ru/product/0.1w-0603-750-om-1
R174 = Chip Resistor: as R42 on sheet BI1; Value: 4870 1%; URL: https://www.chipdip.ru/product0/8002000679
R175 R177-R179 = Chip Resistor: as R43 on sheet BI1; Value: 1k 1%; URL: https://www.chipdip.ru/product0/8002019285
VD20 = S1B: as VD2 on sheet BI1; Case: DO-214AC; Name: S1B; Datasheet: https://static.chipdip.ru/lib/113/DOC032113174.pdf
VD21 = TLV431B: as VD3 on sheet BI1; Case: SOT-23; Name: TLV431B; Datasheet: https://static.chipdip.ru/lib/985/DOC012985043.pdf
VD22 = SMCJ5.0A: as VD4 on sheet BI1; Case: DO-201; Name: SMCJ5.0A; Datasheet: https://static.chipdip.ru/lib/863/DOC025863760.pdf
VT75-VT77 = BC846B: as VT1 on sheet Mode; Case: SOT-23; Name: BC846B; Datasheet: https://static.chipdip.ru/lib/551/DOC012551042.pdf
VT78-VT80 VT85 = BC856: as VT6 on sheet BI1; Case: SOT-23; Name: BC856; Datasheet: https://static.chipdip.ru/lib/365/DOC004365998.pdf
VT81-VT83 = AO3404A: as VT9 on sheet BI1; Case: SOT-23; Name: AO3404A; Datasheet: https://static.chipdip.ru/lib/906/DOC012906979.pdf
VT84 = 2N7002: as VT12 on sheet BI1; Case: SOT-23; Name: 2N7002; Datasheet: https://static.chipdip.ru/lib/301/DOC021301072.pdf
VT86 = KT814Г: as VT14 on sheet BI1; Case: TO-126; Name: KT814Г; Datasheet: https://static.chipdip.ru/lib/404/DOC047404057.pdf

## Sheet BI8.SchDoc
size 420 x 297 mm; DocumentNumber: 13; SheetNumber: 13; SheetTotal: 13; DecimalNumber: СНАБ.468222.001 ЭЗ
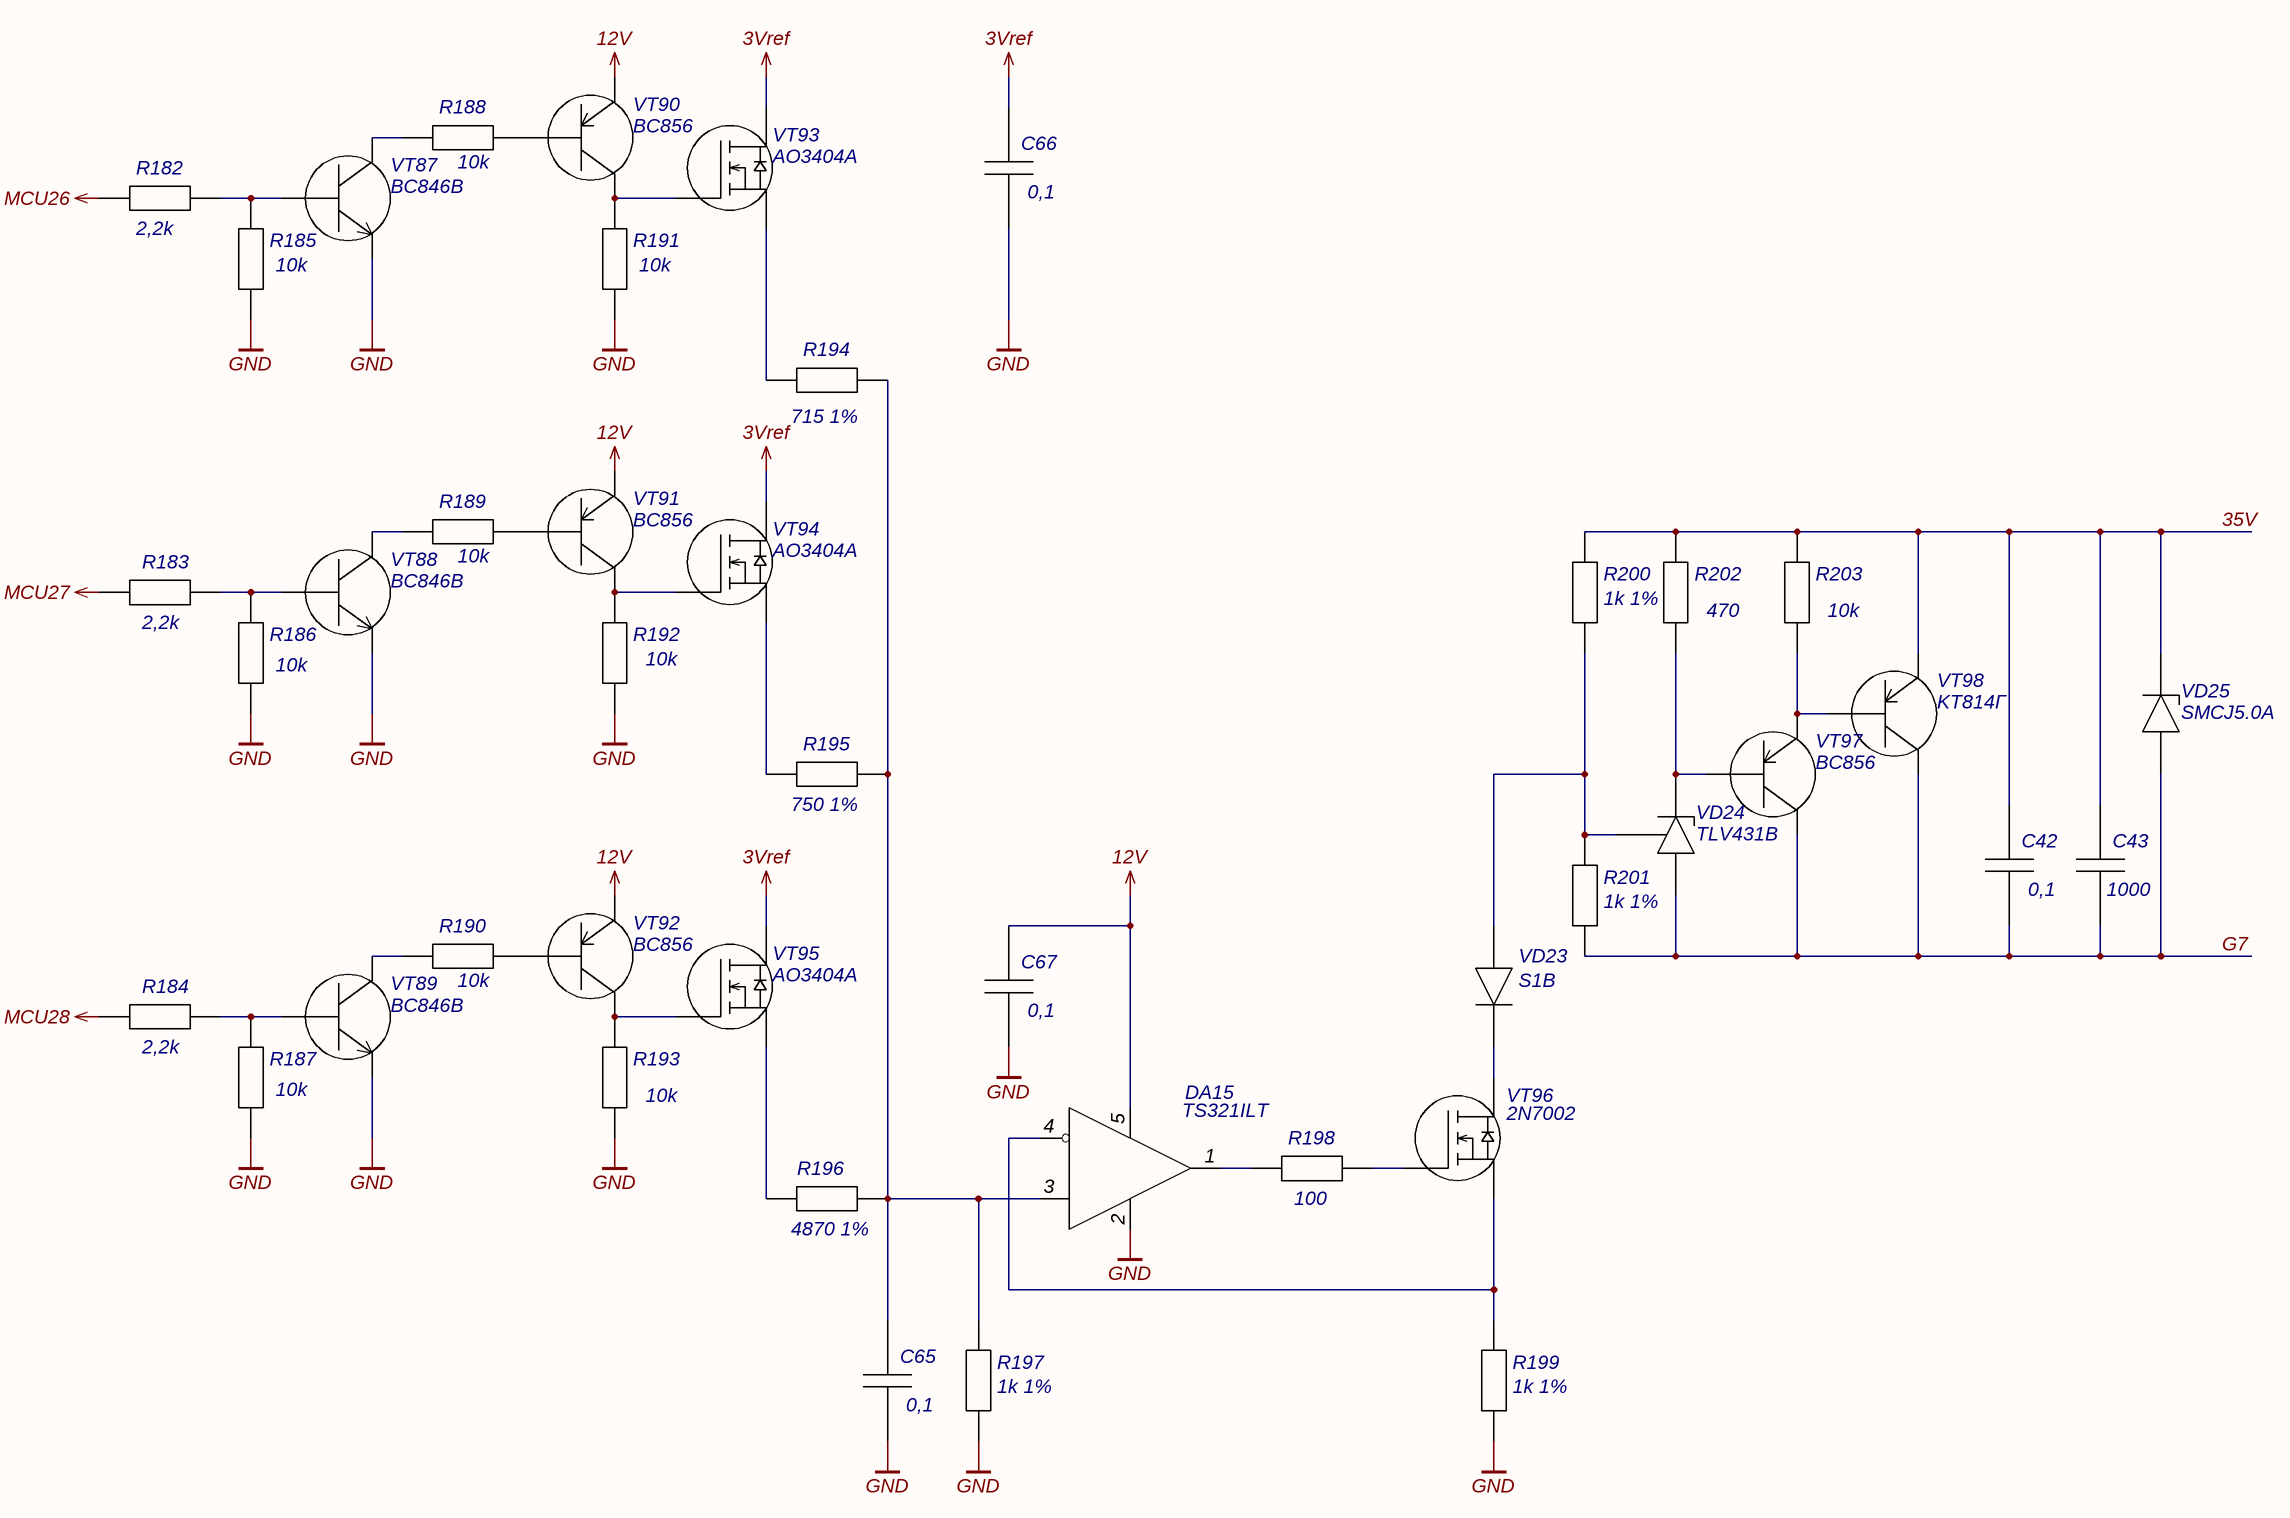
[diagram p12: BI8.SchDoc]

### Parts
C42  0,1  [C0603]
C43  1000  [C0603]
C65  0,1  [C0603]
C66  0,1  [C0603]
C67  0,1  [C0603]
DA15  TS321ILT  [SOT-23-5]
R182  2,2k  [R0603]
R183  2,2k  [R0603]
R184  2,2k  [R0603]
R185  10k  [R0603]
R186  10k  [R0603]
R187  10k  [R0603]
R188  10k  [R0603]
R189  10k  [R0603]
R190  10k  [R0603]
R191  10k  [R0603]
R192  10k  [R0603]
R193  10k  [R0603]
R194  715 1%  [R0603]
R195  750 1%  [R0603]
R196  4870 1%  [R0603]
R197  1k 1%  [R0603]
R198  100  [R0603]
R199  1k 1%  [R0603]
R200  1k 1%  [R0603]
R201  1k 1%  [R0603]
R202  470  [R0603]
R203  10k  [R0603]
VD23  S1B  [DO-214AC]
VD24  TLV431B  [SOT-23]
VD25  SMCJ5.0A  [DO-214AB]
VT87  BC846B  [SOT-23]
VT88  BC846B  [SOT-23]
VT89  BC846B  [SOT-23]
VT90  BC856  [SOT-23]
VT91  BC856  [SOT-23]
VT92  BC856  [SOT-23]
VT93  AO3404A  [SOT-23]
VT94  AO3404A  [SOT-23]
VT95  AO3404A  [SOT-23]
VT96  2N7002  [SOT-23]
VT97  BC856  [SOT-23]
VT98  KT814Г  [TO-126]

### Nets
3Vref: C66.2 VT93.2(D) VT94.2(D) VT95.2(D)
12V: C67.2 DA15.5(Vcc) VT90.1 VT91.1 VT92.1
35V: C42.2 C43.2 R200.2 R202.2 R203.2 VD25.2 VT98.1
G7: C42.1 C43.1 R201.1 VD24.1 VD25.1 VT97.2 VT98.2
GND: C65.1 C66.1 C67.1 DA15.2(GND) R185.1 R186.1 R187.1 R191.1 R192.1 R193.1 R197.1 R199.1 VT87.2(E) VT88.2(E) VT89.2(E)
MCU26: R182.1
MCU27: R183.1
MCU28: R184.1
NetC65_2: C65.2 DA15.3(+) R194.2 R195.2 R196.2 R197.2
NetDA15_1: DA15.1(OUT) R198.1
NetDA15_4: DA15.4(-) R199.2 VT96.3(S)
NetR182_2: R182.2 R185.2 VT87.1(B)
NetR183_2: R183.2 R186.2 VT88.1(B)
NetR184_2: R184.2 R187.2 VT89.1(B)
NetR188_1: R188.1 VT87.3(C)
NetR188_2: R188.2 VT90.3
NetR189_1: R189.1 VT88.3(C)
NetR189_2: R189.2 VT91.3
NetR190_1: R190.1 VT89.3(C)
NetR190_2: R190.2 VT92.3
NetR191_2: R191.2 VT90.2 VT93.1(G)
NetR192_2: R192.2 VT91.2 VT94.1(G)
NetR193_2: R193.2 VT92.2 VT95.1(G)
NetR194_1: R194.1 VT93.3(S)
NetR195_1: R195.1 VT94.3(S)
NetR196_1: R196.1 VT95.3(S)
NetR198_2: R198.2 VT96.1(G)
NetR200_1: R200.1 R201.2 VD23.1 VD24.3
NetR202_1: R202.1 VD24.2 VT97.3
NetR203_1: R203.1 VT97.1 VT98.3
NetVD23_2: VD23.2 VT96.2(D)

### Notes on the sheet
- Подп. и дата
- Инв.№ дубл.
- Взам.инв.№
- Подп.и дата
- Инв.№ подл.
- Изм.
- Лист
- № докум.
- Подп.
- Дата
- Копировал
- Формат  A3

### Library data of the parts
C42 C43 C65-C67 = Chip Capasitor: Чип-конденсатор
  C42 C65-C67: Value: 0,1
  C43: Value: 1000
DA15 = TS321ILT: as DA8 on sheet BI1; Case: SOT-23-5; Name: TS321ILT; Datasheet: https://static.chipdip.ru/lib/710/DOC011710227.pdf
R182-R193 R198 R202 R203 = Chip Resistor: Чип-резистор
  R182-R184: Value: 2,2k
  R185-R193 R203: Value: 10k
  R198: Value: 100
  R202: Value: 470
R194 = Chip Resistor: as R40 on sheet BI1; Value: 715 1%; URL: https://www.chipdip.ru/product0/8002000768
R195 = Chip Resistor: as R41 on sheet BI1; Value: 750 1%; URL: https://www.chipdip.ru/product/0.1w-0603-750-om-1
R196 = Chip Resistor: as R42 on sheet BI1; Value: 4870 1%; URL: https://www.chipdip.ru/product0/8002000679
R197 R199-R201 = Chip Resistor: as R43 on sheet BI1; Value: 1k 1%; URL: https://www.chipdip.ru/product0/8002019285
VD23 = S1B: as VD2 on sheet BI1; Case: DO-214AC; Name: S1B; Datasheet: https://static.chipdip.ru/lib/113/DOC032113174.pdf
VD24 = TLV431B: as VD3 on sheet BI1; Case: SOT-23; Name: TLV431B; Datasheet: https://static.chipdip.ru/lib/985/DOC012985043.pdf
VD25 = SMCJ5.0A: as VD4 on sheet BI1; Case: DO-201; Name: SMCJ5.0A; Datasheet: https://static.chipdip.ru/lib/863/DOC025863760.pdf
VT87-VT89 = BC846B: as VT1 on sheet Mode; Case: SOT-23; Name: BC846B; Datasheet: https://static.chipdip.ru/lib/551/DOC012551042.pdf
VT90-VT92 VT97 = BC856: as VT6 on sheet BI1; Case: SOT-23; Name: BC856; Datasheet: https://static.chipdip.ru/lib/365/DOC004365998.pdf
VT93-VT95 = AO3404A: as VT9 on sheet BI1; Case: SOT-23; Name: AO3404A; Datasheet: https://static.chipdip.ru/lib/906/DOC012906979.pdf
VT96 = 2N7002: as VT12 on sheet BI1; Case: SOT-23; Name: 2N7002; Datasheet: https://static.chipdip.ru/lib/301/DOC021301072.pdf
VT98 = KT814Г: as VT14 on sheet BI1; Case: TO-126; Name: KT814Г; Datasheet: https://static.chipdip.ru/lib/404/DOC047404057.pdf

## Nets that join several sheets
3.3V: Mode (R5.2 R6.2), Power (C6.2 C9.1 DA6.4 HL2.2), MCU (23 pins), Interface (C26.2 DD1.8)
3Vref: Power (C7.2 C10.1 DA7.6), BI1 (C45.2 VT9.2 VT10.2 VT11.2), BI2 (C48.2 VT21.2 VT22.2 VT23.2), BI3 (C51.2 VT33.2 VT34.2 VT35.2), BI4 (C54.2 VT45.2 VT46.2 VT47.2), BI5 (C57.2 VT57.2 VT58.2 VT59.2), BI6 (C60.2 VT69.2 VT70.2 VT71.2), BI7 (C63.2 VT81.2 VT82.2 VT83.2), BI8 (C66.2 VT93.2 VT94.2 VT95.2)
12V: Mode (R7.2), Power (8 pins), BI1 (5 pins), BI2 (5 pins), BI3 (5 pins), BI4 (5 pins), BI5 (5 pins), BI6 (5 pins), BI7 (5 pins), BI8 (5 pins)
35V: Conn (C1.2 FU1.2 XP5.9 XP5.10), Mode (R3.2), Power (C2.2 DA5.1), BI8 (7 pins)
G0: Conn (XP4.3 XP5.1), Mode (VT2.2), BI1 (7 pins)
G1: Conn (XP5.2), BI1 (7 pins), BI2 (7 pins)
G2: Conn (XP5.3), BI2 (7 pins), BI3 (7 pins)
G3: Conn (XP5.4), BI3 (7 pins), BI4 (7 pins)
G4: Conn (XP5.5), BI4 (7 pins), BI5 (7 pins)
G5: Conn (XP5.6), BI5 (7 pins), BI6 (7 pins)
G6: Conn (XP5.7), BI6 (7 pins), BI7 (7 pins)
G7: Conn (XP5.8), BI7 (7 pins), BI8 (7 pins)
GND: Conn (C1.1 XP2.2), Mode (7 pins), Power (14 pins), MCU (37 pins), Interface (8 pins), BI1 (15 pins), BI2 (15 pins), BI3 (15 pins), BI4 (15 pins), BI5 (14 pins), BI6 (15 pins), BI7 (15 pins), BI8 (15 pins)
MCU1: Mode (DA1.1), MCU (D1.16)
MCU2: Mode (DA2.1), MCU (D1.15)
MCU3: Mode (DA3.4 R5.1), MCU (D1.22)
MCU4: Mode (DA4.4 R6.1), MCU (D1.21)
MCU5: MCU (D1.63), BI1 (R28.1)
MCU6: MCU (D1.62), BI1 (R29.1)
MCU7: MCU (D1.61), BI1 (R30.1)
MCU8: MCU (D1.60), BI2 (R50.1)
MCU9: MCU (D1.58), BI2 (R51.1)
MCU10: MCU (D1.59), BI2 (R52.1)
MCU11: MCU (D1.57), BI3 (R72.1)
MCU12: MCU (D1.56), BI3 (R73.1)
MCU13: MCU (D1.55), BI3 (R74.1)
MCU14: MCU (D1.54), BI4 (R94.1)
MCU15: MCU (D1.53), BI4 (R95.1)
MCU16: MCU (D1.52), BI4 (R96.1)
MCU17: MCU (D1.51), BI5 (R116.1)
MCU18: MCU (D1.50), BI5 (R117.1)
MCU19: MCU (D1.42), BI5 (R118.1)
MCU20: MCU (D1.41), BI6 (R138.1)
MCU21: MCU (D1.40), BI6 (R139.1)
MCU22: MCU (D1.36), BI6 (R140.1)
MCU23: MCU (D1.33), BI7 (R160.1)
MCU24: MCU (D1.35), BI7 (R161.1)
MCU25: MCU (D1.34), BI7 (R162.1)
MCU26: MCU (D1.30), BI8 (R182.1)
MCU27: MCU (D1.32), BI8 (R183.1)
MCU28: MCU (D1.31), BI8 (R184.1)
P-: Conn (XP4.2), Mode (DA2.4 DA3.2)
U2Rx: MCU (R25.2), Interface (DD1.6)
U2Tx: MCU (R26.2), Interface (DD1.7)